# Altium project ADAS_ECU_revA.PrjPcb (part 3 of 6)

## Sheet STM32G473RET6_PINOUT.SchDoc
size C; SheetNumber: 17; SheetTotal: 23
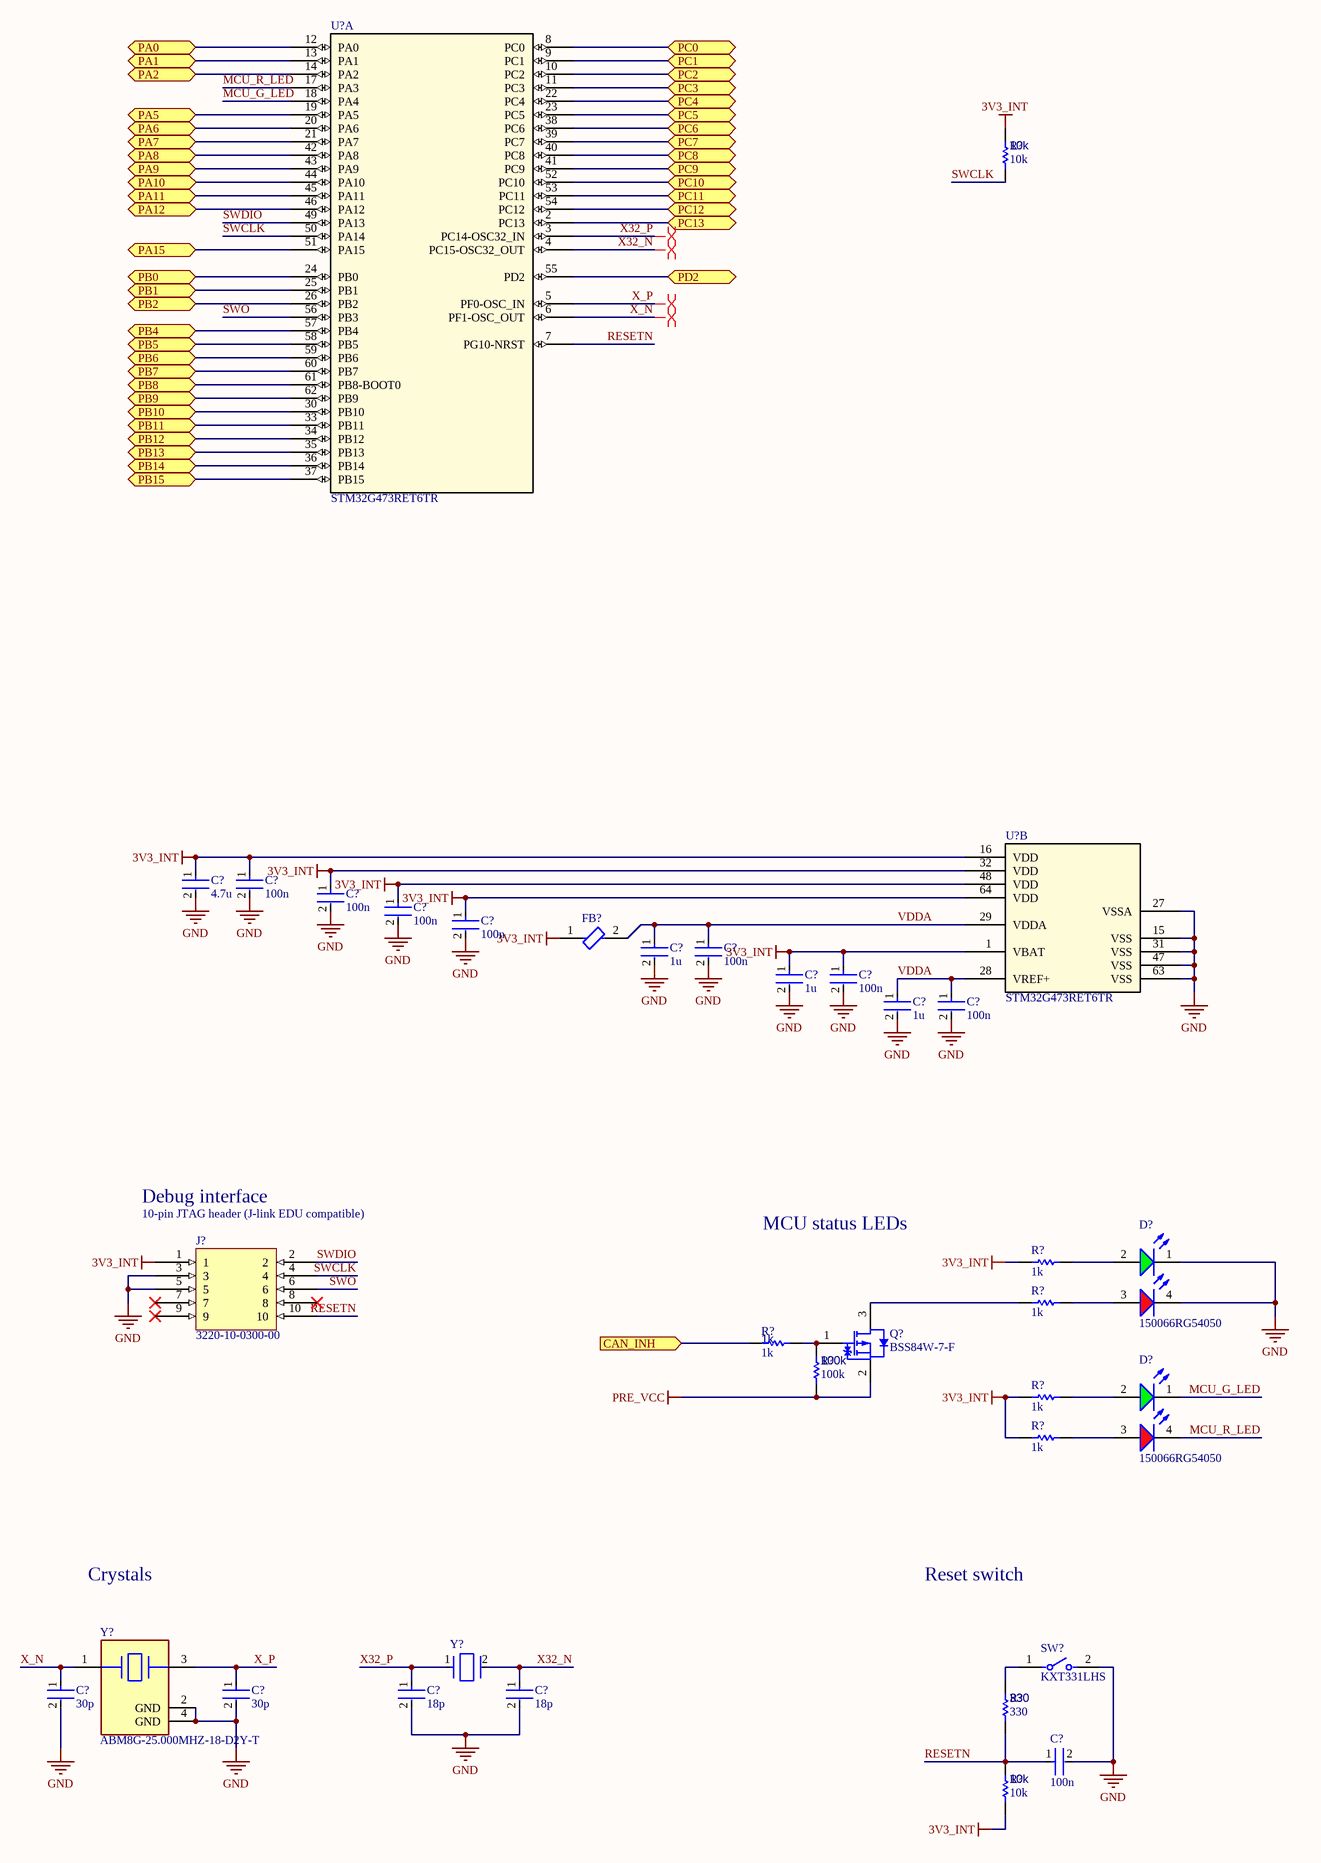
[diagram p21: STM32G473RET6_PINOUT.SchDoc]

### Parts
(Parts that share a designator on the sheet are numbered #1, #2 ... from top to bottom, then left to right.)
C?#1  4.7u  [FP-0402-L_1_0_0_05-W_0_5-IPC_A]
C?#2  100n  [FP-0402-L_1_0_0_05-W_0_5-IPC_A]
C?#3  100n  [FP-0402-L_1_0_0_05-W_0_5-IPC_A]
C?#4  100n  [FP-0402-L_1_0_0_05-W_0_5-IPC_A]
C?#5  100n  [FP-0402-L_1_0_0_05-W_0_5-IPC_A]
C?#6  1u  [FP-0402-L_1_0_0_05-W_0_5-IPC_A]
C?#7  100n  [FP-0402-L_1_0_0_05-W_0_5-IPC_A]
C?#8  1u  [FP-0402-L_1_0_0_05-W_0_5-IPC_A]
C?#9  100n  [FP-0402-L_1_0_0_05-W_0_5-IPC_A]
C?#10  1u  [FP-0402-L_1_0_0_05-W_0_5-IPC_A]
C?#11  100n  [FP-0402-L_1_0_0_05-W_0_5-IPC_A]
C?#12  30p  [FP-0402-L_1_0_0_05-W_0_5-IPC_A]
C?#13  30p  [FP-0402-L_1_0_0_05-W_0_5-IPC_A]
C?#14  18p  [FP-0402-L_1_0_0_05-W_0_5-IPC_A]
C?#15  18p  [FP-0402-L_1_0_0_05-W_0_5-IPC_A]
C?#16  100n  [FP-0402-L_1_0_0_05-W_0_5-IPC_A]
D?#1  150066RG54050  [WL-SBCD_0606]
D?#2  150066RG54050  [WL-SBCD_0606]
FB?  BLM15PX601SN1D  [FP-BLM15-0_05-MFG]  (value not drawn)
J?  3220-10-0300-00  [3220-10-0300-00-Footprint-1]
Q?  BSS84W-7-F  [DIOD-SOT323-3_V]
R?#1  10k  [R0603B]
R?#2  1k  [R0603B]
R?#3  1k  [R0603B]
R?#4  1k  [R0603B]
R?#5  100k  [R0603B]
R?#6  1k  [R0603B]
R?#7  1k  [R0603B]
R?#8  330  [R0603B]
R?#9  10k  [R0603B]
SW?  KXT331LHS  [FP-KXT331LHS-MFG]
U?#1  STM32G473RET6TR  [STM32G473RET6TR-Footprint-1]  (part A of 2)
U?#2  STM32G473RET6TR  [STM32G473RET6TR-Footprint-1]  (part B of 2)
Y?#1  ABM8G-25.000MHZ-18-D2Y-T  [FP-ABM8G-MFG]
Y?#2  ECS-.327-12.5-1210-TR  [FP-ECX-1210-MFG]  (value not drawn)

### Ports
CAN_INH (in), PA0 (bidir), PA1 (bidir), PA2 (bidir), PA5 (bidir), PA6 (bidir), PA7 (bidir), PA8 (bidir), PA9 (bidir), PA10 (bidir), PA11 (bidir), PA12 (bidir), PA15 (bidir), PB0 (bidir), PB1 (bidir), PB2 (bidir), PB4 (bidir), PB5 (bidir), PB6 (bidir), PB7 (bidir), PB8 (bidir), PB9 (bidir), PB10 (bidir), PB11 (bidir), PB12 (bidir), PB13 (bidir), PB14 (bidir), PB15 (bidir), PC0 (bidir), PC1 (bidir), PC2 (bidir), PC3 (bidir), PC4 (bidir), PC5 (bidir), PC6 (bidir), PC7 (bidir), PC8 (bidir), PC9 (bidir), PC10 (bidir), PC11 (bidir), PC12 (bidir), PC13 (bidir), PD2 (bidir)

### Nets
3V3_INT: C?#1.1 C?#2.1 C?#3.1 C?#4.1 C?#5.1 C?#8.1 C?#9.1 FB?.1 J?.1 R?#1.2 R?#2.2 R?#6.2 R?#7.2 R?#9.1 U?#2.1(VBAT) U?#2.16(VDD) U?#2.32(VDD) U?#2.48(VDD) U?#2.64(VDD)
GND: C?#1.2 C?#2.2 C?#3.2 C?#4.2 C?#5.2 C?#6.2 C?#7.2 C?#8.2 C?#9.2 C?#10.2 C?#11.2 C?#12.2 C?#13.2 C?#14.2 C?#15.2 C?#16.2 D?#1.1(K) D?#1.4(K) J?.3 J?.5 SW?.2 U?#2.15(VSS) U?#2.27(VSSA) U?#2.31(VSS) U?#2.47(VSS) U?#2.63(VSS) Y?#1.2(GND) Y?#1.4(GND)
PRE_VCC: Q?.2(S) R?#5.2
MCU_G_LED: D?#2.1(K) U?#1.18(PA4)
MCU_R_LED: D?#2.4(K) U?#1.17(PA3)
RESETN: C?#16.1 J?.10 R?#8.1 R?#9.2 U?#1.7(PG10-NRST)
SWCLK: J?.4 R?#1.1 U?#1.50(PA14)
SWDIO: J?.2 U?#1.49(PA13)
SWO: J?.6 U?#1.56(PB3)
VDDA: C?#6.1 C?#7.1 C?#10.1 C?#11.1 FB?.2 U?#2.28(VREF+) U?#2.29(VDDA)
X32_N: C?#15.1 U?#1.4(PC15-OSC32_OUT) Y?#2.2(Out/In)
X32_P: C?#14.1 U?#1.3(PC14-OSC32_IN) Y?#2.1(In/Out)
X_N: C?#12.1 U?#1.6(PF1-OSC_OUT) Y?#1.1
X_P: C?#13.1 U?#1.5(PF0-OSC_IN) Y?#1.3
NetD?#1_2: D?#1.2(A) R?#2.1
NetD?#1_3: D?#1.3(A) R?#3.1
NetD?#2_2: D?#2.2(A) R?#6.1
NetD?#2_3: D?#2.3(A) R?#7.1
NetQ?_1: Q?.1(G) R?#4.1 R?#5.1
NetQ?_3: Q?.3(D) R?#3.2
NetR?#4_2: R?#4.2 ; port CAN_INH
NetR?#8_2: R?#8.2 SW?.1
NetU?#1_2: U?#1.2(PC13) ; port PC13
NetU?#1_8: U?#1.8(PC0) ; port PC0
NetU?#1_9: U?#1.9(PC1) ; port PC1
NetU?#1_10: U?#1.10(PC2) ; port PC2
NetU?#1_11: U?#1.11(PC3) ; port PC3
NetU?#1_12: U?#1.12(PA0) ; port PA0
NetU?#1_13: U?#1.13(PA1) ; port PA1
NetU?#1_14: U?#1.14(PA2) ; port PA2
NetU?#1_19: U?#1.19(PA5) ; port PA5
NetU?#1_20: U?#1.20(PA6) ; port PA6
NetU?#1_21: U?#1.21(PA7) ; port PA7
NetU?#1_22: U?#1.22(PC4) ; port PC4
NetU?#1_23: U?#1.23(PC5) ; port PC5
NetU?#1_24: U?#1.24(PB0) ; port PB0
NetU?#1_25: U?#1.25(PB1) ; port PB1
NetU?#1_26: U?#1.26(PB2) ; port PB2
NetU?#1_30: U?#1.30(PB10) ; port PB10
NetU?#1_33: U?#1.33(PB11) ; port PB11
NetU?#1_34: U?#1.34(PB12) ; port PB12
NetU?#1_35: U?#1.35(PB13) ; port PB13
NetU?#1_36: U?#1.36(PB14) ; port PB14
NetU?#1_37: U?#1.37(PB15) ; port PB15
NetU?#1_38: U?#1.38(PC6) ; port PC6
NetU?#1_39: U?#1.39(PC7) ; port PC7
NetU?#1_40: U?#1.40(PC8) ; port PC8
NetU?#1_41: U?#1.41(PC9) ; port PC9
NetU?#1_42: U?#1.42(PA8) ; port PA8
NetU?#1_43: U?#1.43(PA9) ; port PA9
NetU?#1_44: U?#1.44(PA10) ; port PA10
NetU?#1_45: U?#1.45(PA11) ; port PA11
NetU?#1_46: U?#1.46(PA12) ; port PA12
NetU?#1_51: U?#1.51(PA15) ; port PA15
NetU?#1_52: U?#1.52(PC10) ; port PC10
NetU?#1_53: U?#1.53(PC11) ; port PC11
NetU?#1_54: U?#1.54(PC12) ; port PC12
NetU?#1_55: U?#1.55(PD2) ; port PD2
NetU?#1_57: U?#1.57(PB4) ; port PB4
NetU?#1_58: U?#1.58(PB5) ; port PB5
NetU?#1_59: U?#1.59(PB6) ; port PB6
NetU?#1_60: U?#1.60(PB7) ; port PB7
NetU?#1_61: U?#1.61(PB8-BOOT0) ; port PB8
NetU?#1_62: U?#1.62(PB9) ; port PB9

Not connected (* = marked no-connect by the designer): J? 7* 8* 9*

### Layout directives
differential pair: X32_N, X32_P, X_N, X_P

### Notes on the sheet
- Debug interface
- (near J?) 10-pin JTAG header (J-link EDU compatible)
- MCU status LEDs
- Crystals
- Reset switch

### Library data of the parts
C?#1-C?#16 = CMP-001-00058-1: as C231-C233 on sheet JETSON_V2; Min Operating Temperature: -55°C; Mounting Technology: Surface Mount; Pins: 2; Case/Package: 0402; RoHS Compliant: Yes; Max Operating Temperature: 85°C
  C?#1: Value: 4.7u
  C?#2-C?#5 C?#7 C?#9 C?#11 C?#16: Value: 100n
  C?#6 C?#8 C?#10: Value: 1u
  C?#12 C?#13: Value: 30p
  C?#14 C?#15: Value: 18p
D?#1 D?#2 = CMP-004-00040-2: Led, Red/Grn, 180Mcd/230Mcd, 624Nm/525Nm Rohs Compliant: Yes; Source: rgled.SchLib; Component Type: Standard; Design Item ID: CMP-004-00034-2; Pins: 4
FB? = CMP-0686-00252-4: Chip Ferrite Bead, 0402, 600Ω @ 100MHz, 0.23Ω, 25%, 900mA; Number of Circuits: 1; Impedance: 600R; DC Resistance (DCR): 230mR; Material: Steel; Length: 1mm; Package Quantity: 10000; Height: 0.5mm; Width: 0.5mm; Max DC Current: 900mA; Number of Lines: 1; Termination: SMD/SMT; Packaging: Tape and Reel; Lead Free: Lead Free; Min Operating Temperature: -55°C; Max Operating Temperature: 125°C; Max Current Rating: 900mA; Case Code (Imperial): 0402; Number of Pins: 2; Current Rating: 900mA; Test Frequency: 100MHz; Case/Package: 0402; Tolerance: 25%; Case Code (Metric): 1005
J? = CMP-001-0013-3: CONN HEADER SMD 10POS 1.27MM
Q? = CMP-2000-06170-1: DIFF P/N!!! / P-Channel Enhancement Mode MOSFET, 310 mW, 20 V, -55 to 150 degC, 3-Pin SOT-323, RoHS, Tape and Reel; Manufacturer: Diodes Inc; Qg Gate Charge: 0.622nC; Drain-Source On Resistance-Max: 750mO; Rated Power Dissipation: 310mW; Drain-to-Source Voltage [Vdss]: 20V; Package Reference: SOT323; Datasheet Version: Rev. 3-2, 09/2013; Package Description: 3-Pin Small Outline Transistor, Body 2 x 1.25 mm, Pitch 0.65 mm; Mounting Technology: SurfaceMount; Manufacturer URL: http://www.diodes.com/; Datasheet URL: http://www.diodes.com/_files/datasheets/ds31861.pdf; Channel Type: P-Channel
R?#1-R?#9 = CMP-009-00002-14: Resistor
  R?#1 R?#9: Value: 10k
  R?#2-R?#4 R?#6 R?#7: Value: 1k
  R?#5: Value: 100k
  R?#8: Value: 330
SW? = CMP-10040-000029-1: SWITCH TACTILE SPST-NO 0.02A 15V; Operating Force: 240gf; Switch Travel: 0.13mm; Illumination Type: Non-Illuminated; Throw Configuration: SPST; Number of Ports: 1; Current Rating: 5A; Mechanical Life: 500000Cycles; Switch Function: Off-Mom; Connector Type: USB; Actuator Type: Standard; Gender: Receptacle; Number of Contacts: 24; Contact Plating: Gold; Insulation Color: Black; Min Operating Temperature: -40°C; Packaging: Tape and Reel; Flammability Rating: UL94 V-0; Max Operating Temperature: 85°C; Termination: Solder; Mount: Surface Mount
U?#1 U?#2 = CMP-020-00020-2: MCU 32-Bit STM32 ARM Cortex-M4 RISC 512KB Flash 1.71V to 3.6V 64-Pin LQFP T/R; RoHS Compliant: Yes
Y?#1 = CMP-2000-05733-3: Crystal 25MHz ±20ppm (Tol) ±30ppm (Stability) 18pF FUND 60Ω 4-Pin SMD T/R; Series Resistance: 60R; Length: 3.2mm; Depth: 2.5mm; Packaging: Tape and Reel; Min Operating Temperature: -40°C; Operating Frequency: 25 MHz; Lead Free: Lead Free; Number of Pins: 4; Frequency Tolerance: 20ppm; Radiation Hardening: No; Max Operating Temperature: 85°C; Termination: SMD/SMT; Frequency Stability: 30ppm; Frequency: 25MHz; Series: ABM8G; Mount: Surface Mount; Package Quantity: 1000; Height: 0.039inch; Width: 0.098inch; Case/Package: CSMD; ESR (Equivalent Series Resistance): 60R; Load Capacitance: 18pF; Tolerance: 20ppm
Y?#2 = CMP-40224-000006-1: CRYSTAL 32.7680KHZ 12.5PF SMD; Manufacturer: ECS International; Frequency: 32.768kHz; Esr: 90kΩ; Tolerance: 20ppm; Device Class L1: Passive Components; Load Capacitance: 12.5pF; Temperature: -40°C to +85°C; ComponentLink2URL: https://ecsxtal.com/store/pdf/ECX-1210.pdf; Series: ECX-1210; Octopart: https://octopart.com/ecs-.327-12.5-1210-tr-ecs+international-81221340; ComponentLink2Description: Datasheet; Temperature Range Low: -40°C; Digikey Description: CRYSTAL 32.7680KHZ 12.5PF SMD; Lead Free: Yes; RoHS: TRUE; Device Class L3: Crystals; Automotive: No; Category: Crys; Height: 0.5mm; Manufacturer Part Number: ECS-.327-12.5-1210-TR; Temperature Range High: +85°C; Device Class L2: Crystals / Oscillators; Package: ECX-1210

## Sheet TCAN1146_PINOUT.SchDoc
size B; SheetNumber: 15; SheetTotal: 19
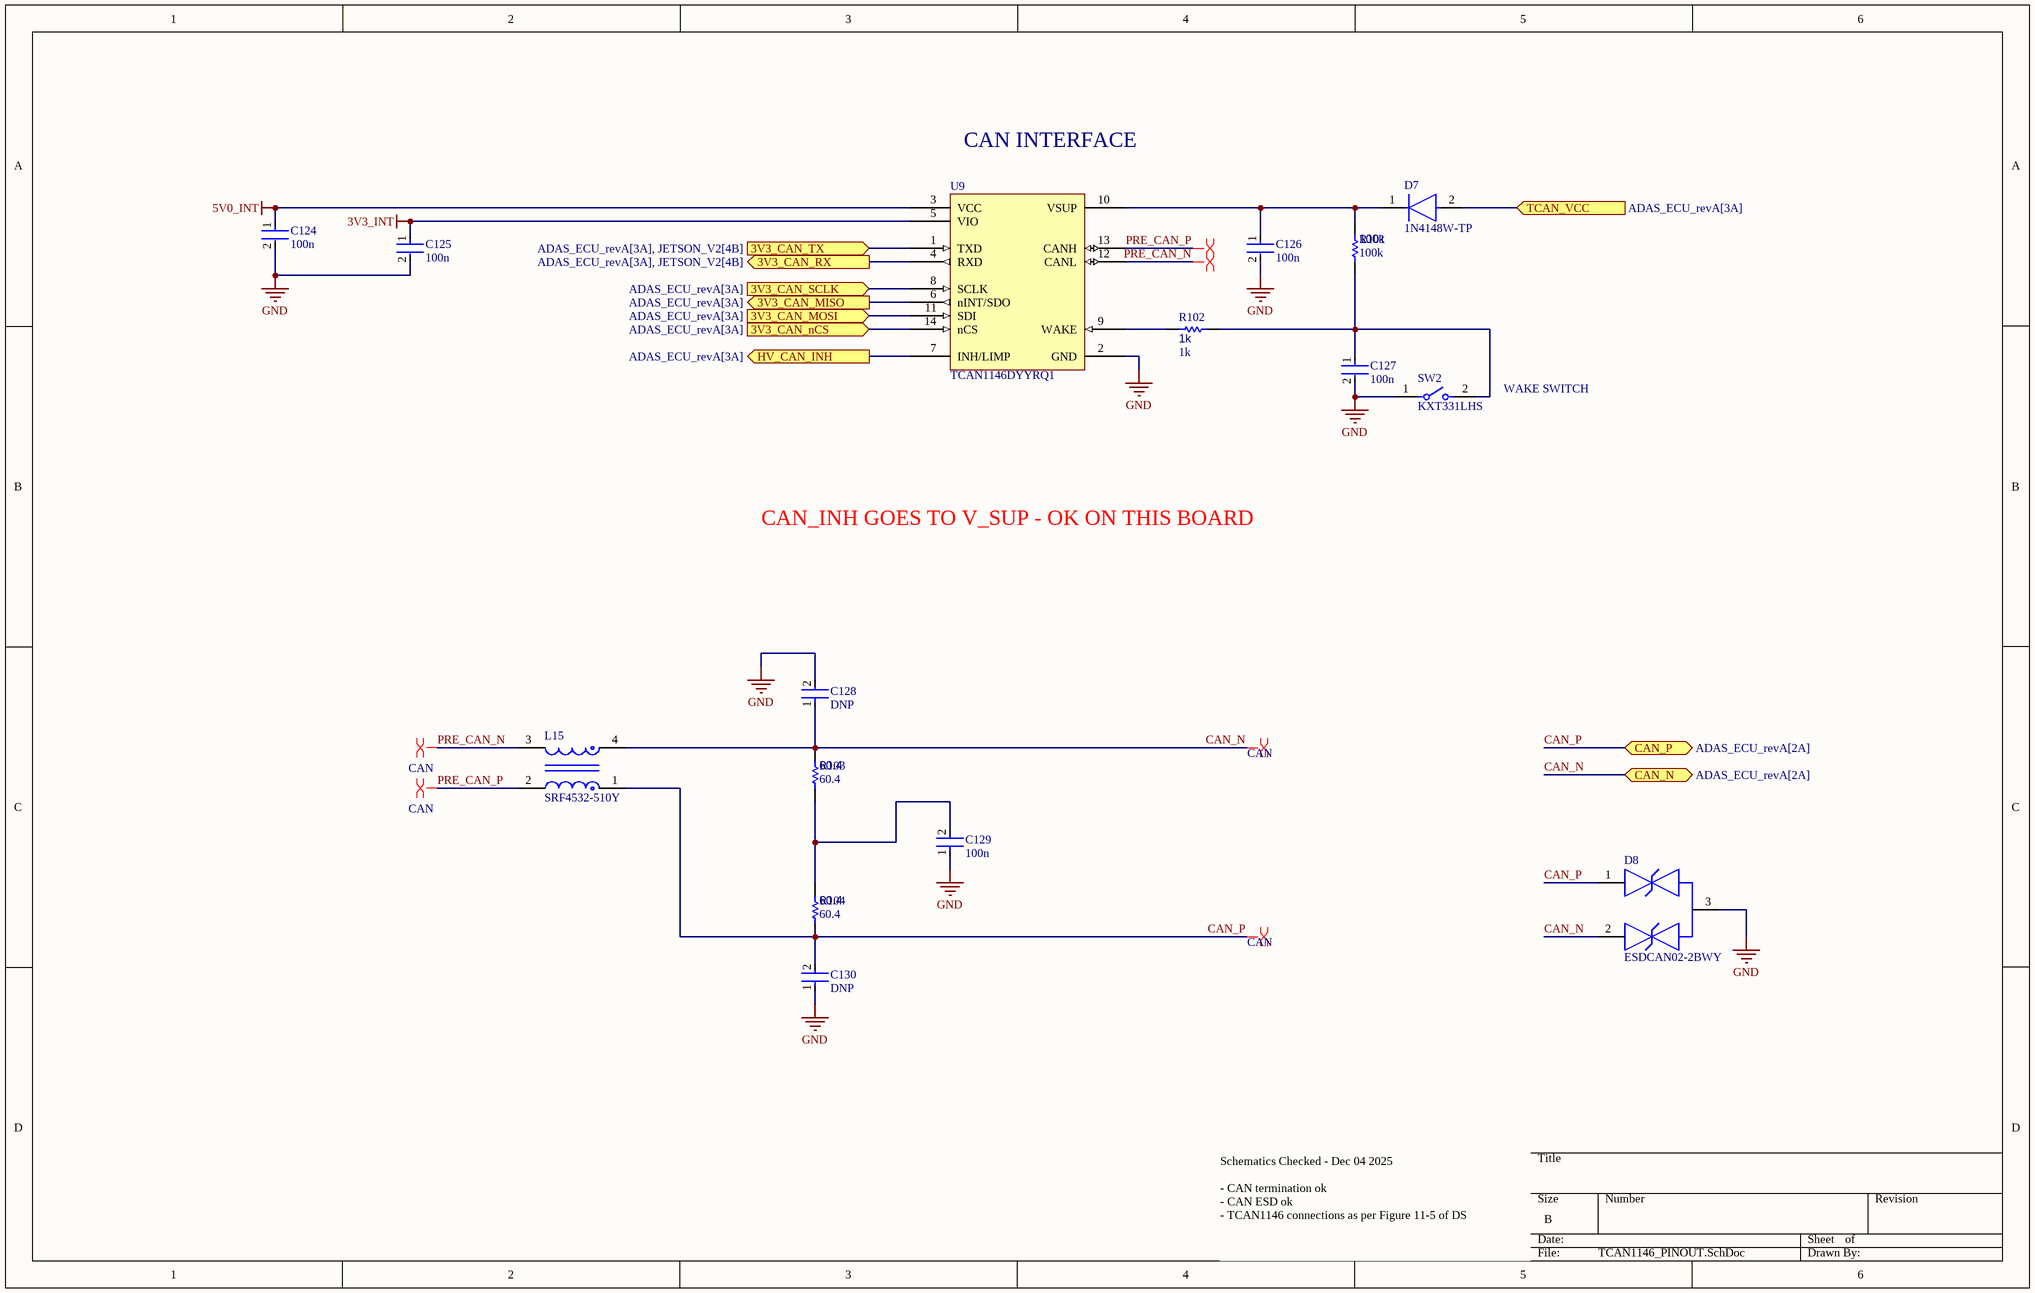
[diagram p22: TCAN1146_PINOUT.SchDoc]

### Parts
C124  100n  [FP-0402-L_1_0_0_05-W_0_5-IPC_A]
C125  100n  [FP-0402-L_1_0_0_05-W_0_5-IPC_A]
C126  100n  [FP-0402-L_1_0_0_05-W_0_5-IPC_A]
C127  100n  [FP-0402-L_1_0_0_05-W_0_5-IPC_A]
C128  DNP  [FP-0402-L_1_0_0_05-W_0_5-IPC_A]
C129  100n  [FP-0402-L_1_0_0_05-W_0_5-IPC_A]
C130  DNP  [FP-0402-L_1_0_0_05-W_0_5-IPC_A]
D7  1N4148W-TP  [FP-SOD-123-IPC_A]
D8  ESDCAN02-2BWY  [FP-SOT323-3L-MFG]
L15  SRF4532-510Y  [FP-SRF4532-MFG]
R101  100k  [R0603B]
R102  1k  [R0603B]
R103  60.4  [R0603B]
R104  60.4  [R0603B]
SW2  KXT331LHS  [FP-KXT331LHS-MFG]
U9  TCAN1146DYYRQ1  [TCAN1146DYYRQ1-Footprint-1]

### Ports
3V3_CAN_MISO (out, see ADAS_ECU_revA[3A]), 3V3_CAN_MOSI (in, see ADAS_ECU_revA[3A]), 3V3_CAN_nCS (in, see ADAS_ECU_revA[3A]), 3V3_CAN_RX (out, see ADAS_ECU_revA[3A], JETSON_V2[4B]), 3V3_CAN_SCLK (in, see ADAS_ECU_revA[3A]), 3V3_CAN_TX (in, see ADAS_ECU_revA[3A], JETSON_V2[4B]), CAN_N (bidir, see ADAS_ECU_revA[2A]), CAN_P (bidir, see ADAS_ECU_revA[2A]), HV_CAN_INH (out, see ADAS_ECU_revA[3A]), TCAN_VCC (in, see ADAS_ECU_revA[3A])

### Nets
3V3_INT: C125.1 U9.5(VIO)
5V0_INT: C124.1 U9.3(VCC)
GND: C124.2 C125.2 C126.2 C127.2 C128.2 C129.1 C130.1 D8.3 SW2.1 U9.2(GND)
PRE_VCC: D7.2(A) ; port TCAN_VCC
3V3_CAN_RX: U9.4(RXD) ; port 3V3_CAN_RX
3V3_CAN_TX: U9.1(TXD) ; port 3V3_CAN_TX
3V3_TCAN1146_MISO: U9.6(nINT/SDO) ; port 3V3_CAN_MISO
3V3_TCAN1146_MOSI: U9.11(SDI) ; port 3V3_CAN_MOSI
3V3_TCAN1146_nCS: U9.14(nCS) ; port 3V3_CAN_nCS
3V3_TCAN1146_SCLK: U9.8(SCLK) ; port 3V3_CAN_SCLK
CAN_N: C128.1 D8.2 L15.4 R103.2 ; port CAN_N
CAN_P: C130.2 D8.1 L15.1 R104.1 ; port CAN_P
HV_PWR_EN: U9.7(INH/LIMP) ; port HV_CAN_INH
PRE_CAN_N: L15.3 U9.12(CANL)
PRE_CAN_P: L15.2 U9.13(CANH)
NetC126_1: C126.1 D7.1(C) R101.2 U9.10(VSUP)
NetC127_1: C127.1 R101.1 R102.2 SW2.2
NetC129_2: C129.2 R103.1 R104.2
NetR102_1: R102.1 U9.9(WAKE)

### Layout directives
differential pair: PRE_CAN_N, PRE_CAN_P
differential pair; differential pair class CAN: CAN_N, CAN_P, PRE_CAN_N, PRE_CAN_P

### Notes on the sheet
- CAN INTERFACE
- WAKE SWITCH
- CAN_INH GOES TO V_SUP - OK ON THIS BOARD
- Schematics Checked - Dec 04 2025
  - CAN termination ok
  - CAN ESD ok
  - TCAN1146 connections as per Figure 11-5 of DS

### Library data of the parts
C124-C130 = CMP-001-00058-1: as C231-C233 on sheet JETSON_V2; Min Operating Temperature: -55°C; Mounting Technology: Surface Mount; Pins: 2; Case/Package: 0402; RoHS Compliant: Yes; Max Operating Temperature: 85°C
D7 = CMP-2000-04993-2: DIODE GEN PURP 100V 150MA SOD123; Max Reverse Leakage Current: 5uA; Max Surge Current: 2A; Reverse Recovery Time: 4ns; Polarity: Standard; Capacitance: 4pF; Max Forward Surge Current (Ifsm): 1A; Element Configuration: Single; Power Dissipation: 400mW; Forward Voltage: 1V; Radiation Hardening: No; Lead Free: Lead Free; Max Reverse Voltage (DC): 100V; Current Rating: 150mA; Forward Current: 150mA; Packaging: Tape and Reel; Number of Pins: 2; Package Quantity: 3000; Max Operating Temperature: 150°C; Min Operating Temperature: -65°C; Average Rectified Current: 150mA; Recovery Time: 4ns; Output Current: 150mA; Peak Non-Repetitive Surge Current: 2A; Width: 1.8mm; Voltage Rating (DC): 100V; Height: 1.2mm; Max Repetitive Reverse Voltage (Vrrm): 100V; Mount: Surface Mount; Length: 2.85mm
D8 = CMP-12225-000055-1: TVS DIODE 26.5V 44V SOT323-3; Manufacturer: STMicroelectronics; Value: 3pF; Direction: Bidirectional; Breakdown Voltage: 28.5V; Automotive Grade: Grade 0; Standoff Height: 0mm; Peak Pulse Power: 170W; Peak Pulse Current: 3A; Number Of Channels: 2; Max Junction Temp: +175°C; Mouser Description: TVS Diodes / ESD Suppressors Automotive dual-line Transil, Transient voltage suppressor (TVS) for CAN bus; Height: 1.1mm; Category: Diode; Reverse Standoff Voltage: 26.5V; Device Class L1: Circuit Protection; Temperature: -55°C to +175°C; RoHS: TRUE; ComponentLink2URL: https://www.st.com/resource/en/datasheet/esdcan02-2bwy.pdf; Device Class L3: unset; Device Class L2: TVS Diodes; Temperature Range High: +175°C; Octopart: https://octopart.com/esdcan02-2bwy-stmicroelectronics-58631133; Ipc Land Pattern Name: SOT65P210X95-3; Temperature Range Low: -55°C; Capacitance: 3pF; Digikey Description: TVS DIODE 26.5V 44V SOT323-3; Automotive: Yes; ComponentLink2Description: Datasheet; Clamping Voltage: 44V; Manufacturer Part Number: ESDCAN02-2BWY; Lead Free: Yes; Package: SOT323-3L
L15 = CMP-07251-000006-1: CMC 51UH 200MA 2LN 2KOHM SMD; Element Configuration: Dual; Number of Lines: 2; Core Material: Ferrite; Impedance: 2kR; Test Frequency: 100kHz; Voltage Rating (DC): 50V; Insulation Resistance: 10MR; Material: Steel; Tolerance: 50%; DC Resistance (DCR): 3.5R; RoHS Compliant: Yes; Mount: Surface Mount; REACH SVHC: No SVHC; Termination: SMD/SMT; DC Current: 200mA; Current: 200mA; Lead Free: Lead Free; Contact Plating: Tin; Length: 4.5mm; Max DC Current: 200mA; Width: 0.126inch; Case/Package: 4532; Packaging: Tape and Reel; Package Quantity: 1; Min Operating Temperature: -40°C; Depth: 3.4mm; Series: SRF4532; Max Operating Temperature: 125°C; Current Rating: 200mA; Self Resonant Frequency: 100kHz; Height: 0.118inch; Inductance: 51uH; Resistance: 2kR
R101-R104 = CMP-009-00002-14: Resistor
  R101: Value: 100k
  R102: Value: 1k
  R103 R104: Value: 60.4
SW2 = CMP-10040-000029-1: as SW? on sheet STM32G473RET6_PINOUT; Contact Plating: Gold; Insulation Color: Black; Min Operating Temperature: -40°C; Packaging: Tape and Reel; Flammability Rating: UL94 V-0; Max Operating Temperature: 85°C; Termination: Solder; Mount: Surface Mount
U9 = CMP-318-000000-2: Automotive CAN FD transceiver with watchdog, bus diagnostics and partial networking via sele 14-SOT-23-THIN -40 to 150; Component Type: Standard; Design Item ID: CMP-015-00012-2; Pin Count: 14; Source: TCAN1146DYYRQ1.SchLib

## Sheet LM74910H_PINOUT.SchDoc
size B; SheetNumber: 12; SheetTotal: 19
Used 2 times, as channels OR_0, OR_1. Parts and nets are listed once, with the designators drawn on the sheet.
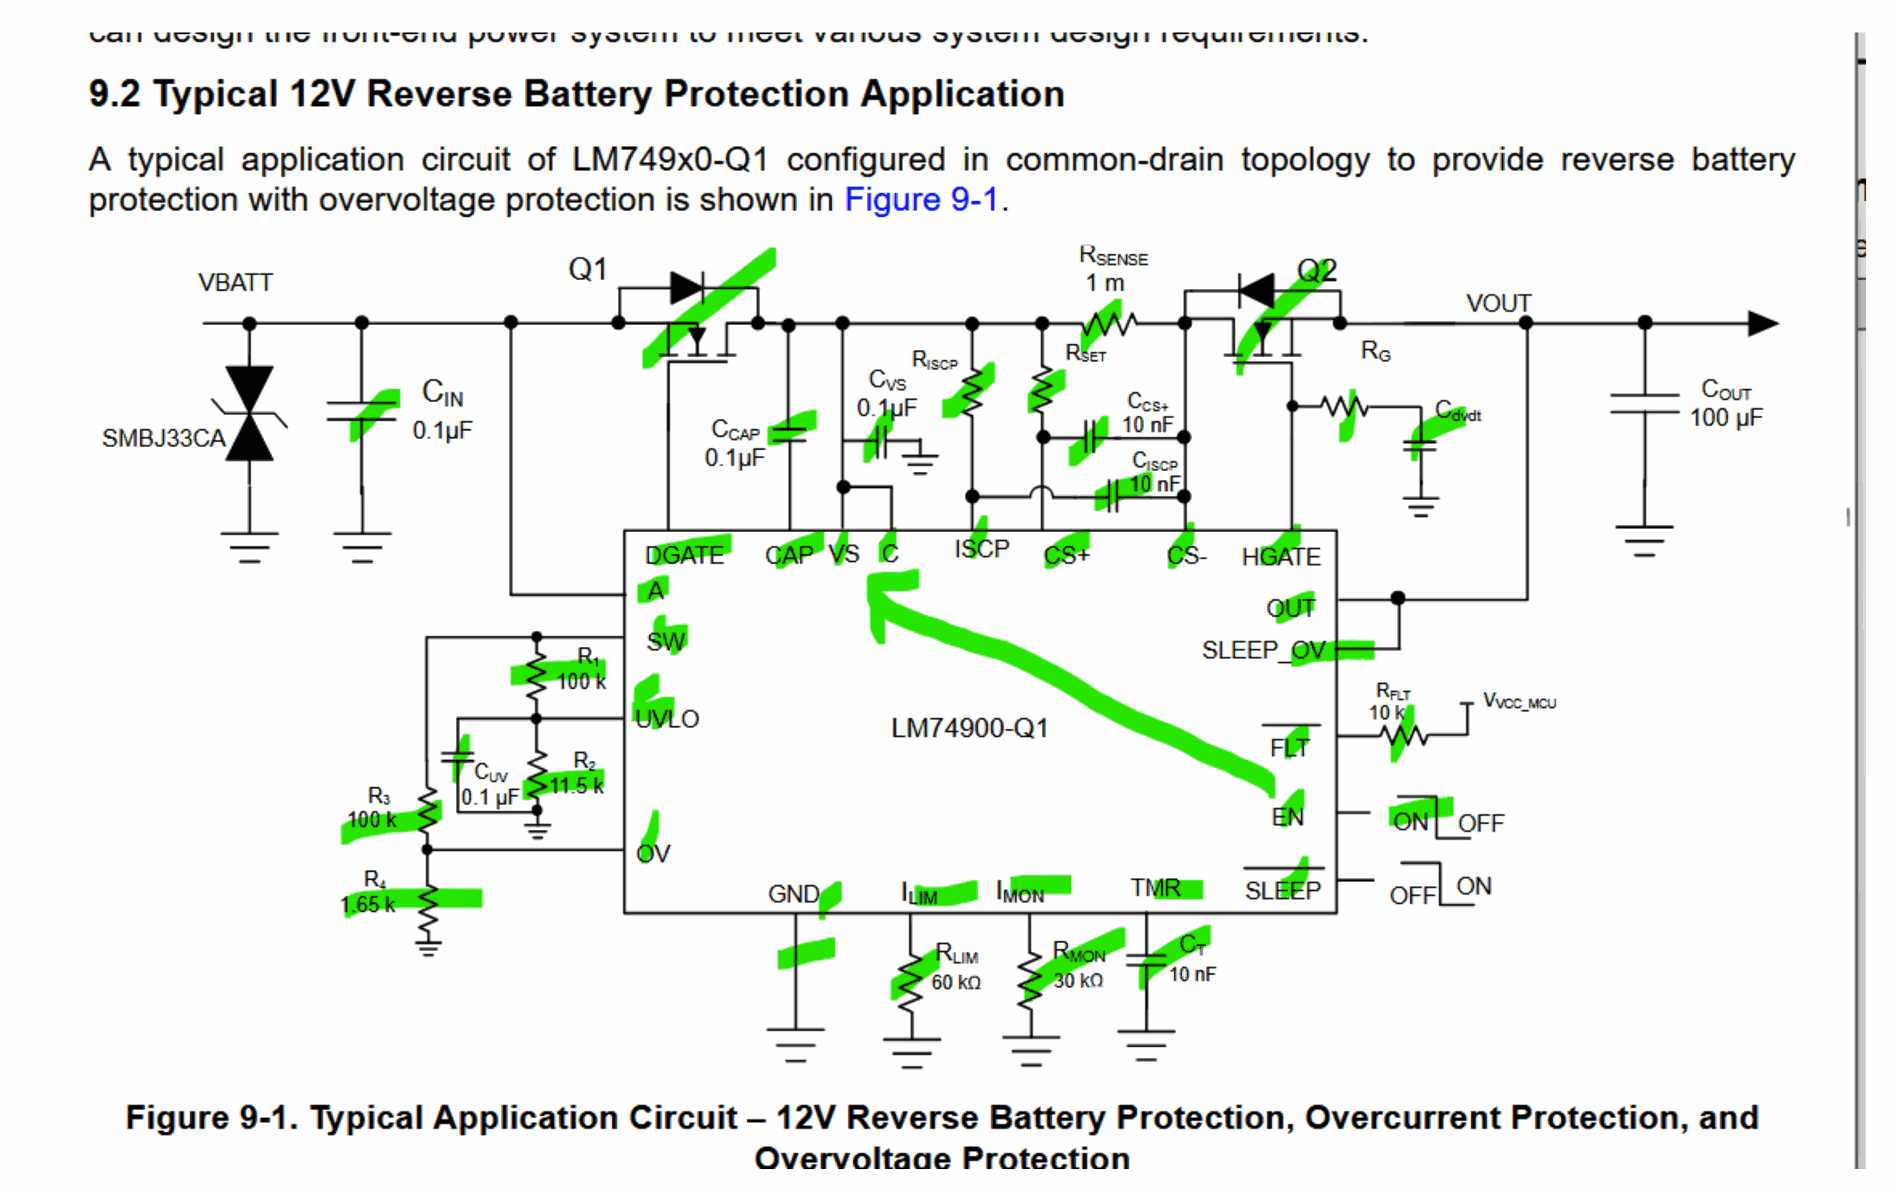
[diagram p23: LM74910H_PINOUT.SchDoc, top]
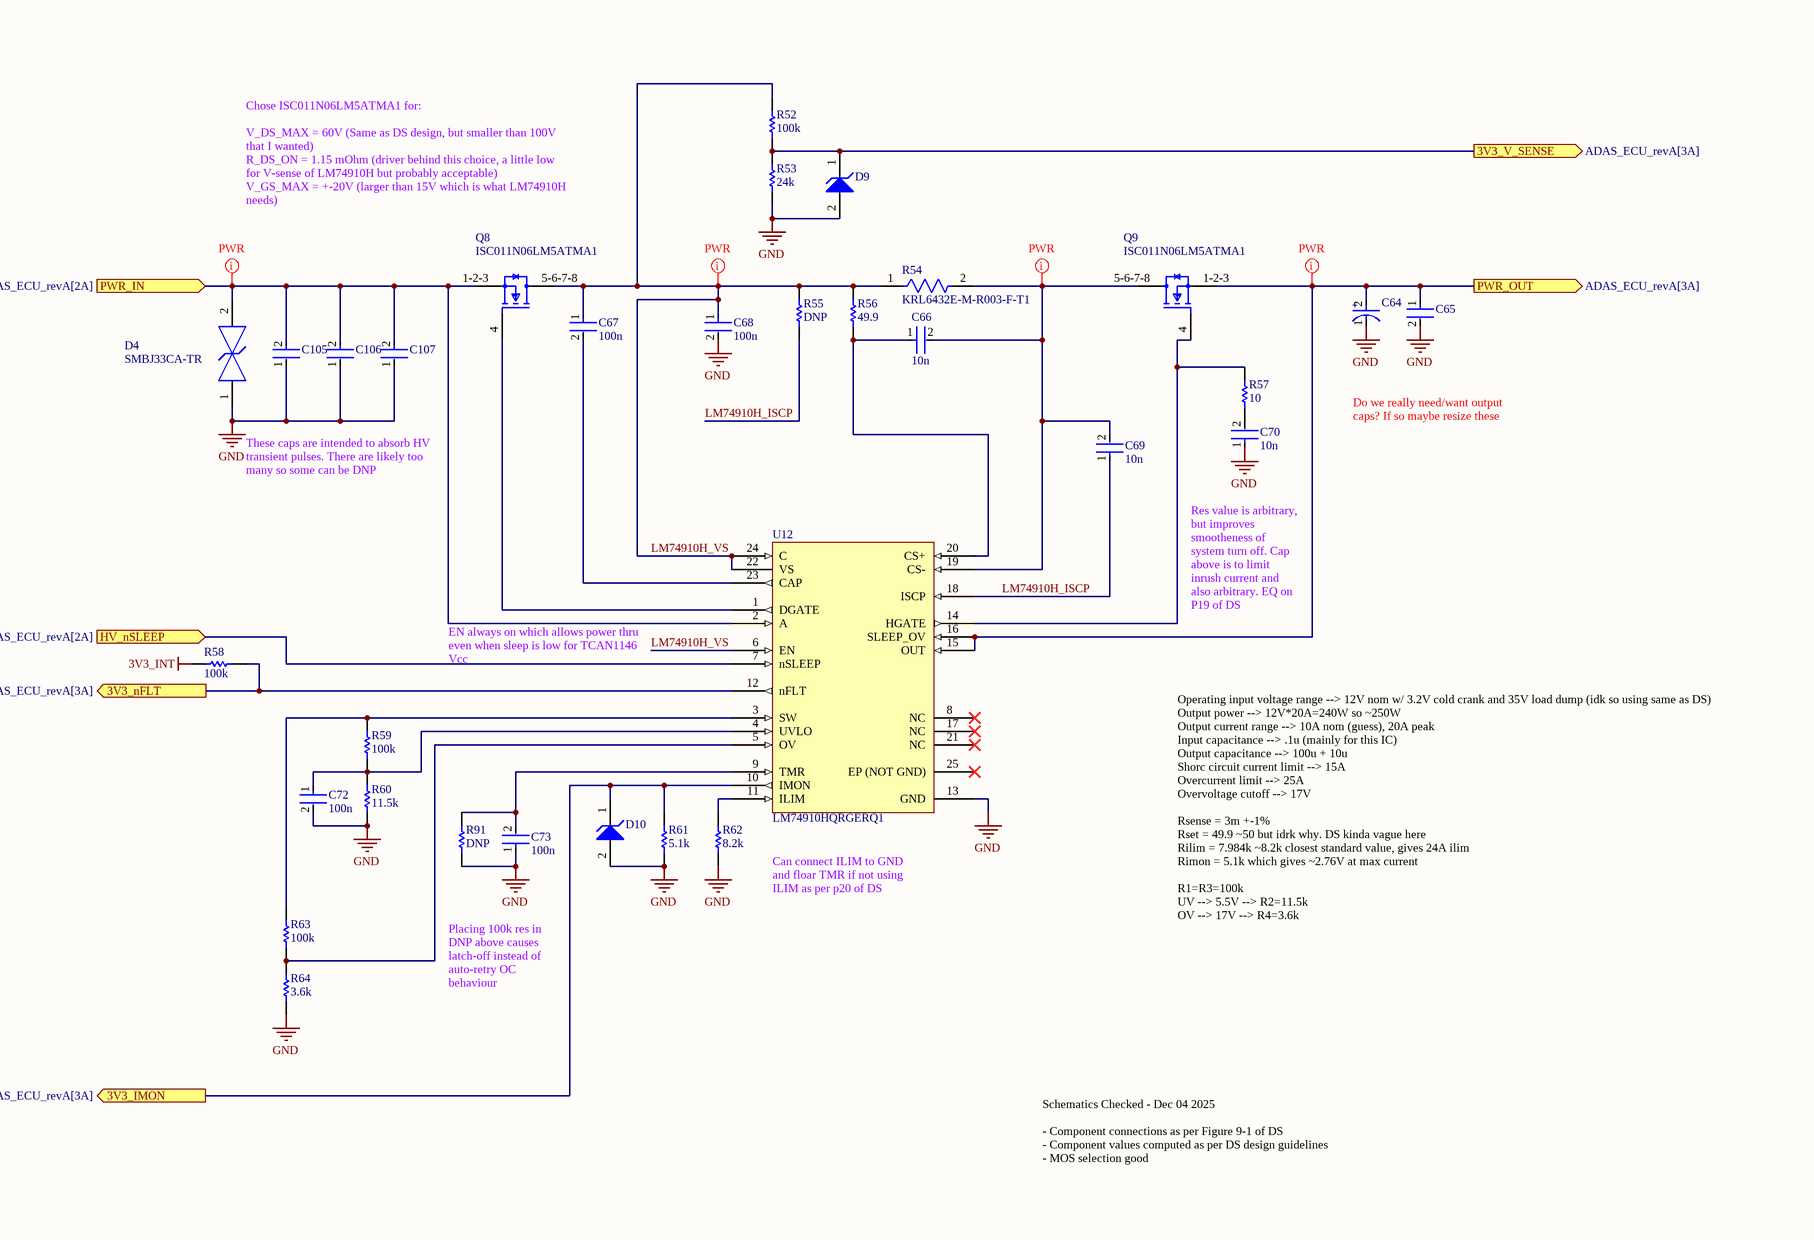
[diagram p24: LM74910H_PINOUT.SchDoc, bottom]

### Parts
C64  EEE-FK1H100UR  [FP-FKC-MFG]  (value not drawn)
C65  12103D106KAT2A  [FP-1210-L_3_3_0_4-W_2_5_0-MFG]  (value not drawn)
C66  10n  [FP-0402-L_1_0_0_05-W_0_5-IPC_A]
C67  100n  [FP-0402-L_1_0_0_05-W_0_5-IPC_A]
C68  100n  [FP-0402-L_1_0_0_05-W_0_5-IPC_A]
C69  10n  [FP-0402-L_1_0_0_05-W_0_5-IPC_A]
C70  10n  [FP-0402-L_1_0_0_05-W_0_5-IPC_A]
C72  100n  [FP-0402-L_1_0_0_05-W_0_5-IPC_A]
C73  100n  [FP-0402-L_1_0_0_05-W_0_5-IPC_A]
C105  AC1210KKX7R0BB104  [FP-AC1210-0_85-MFG]  (value not drawn)
C106  AC1210KKX7R0BB104  [FP-AC1210-0_85-MFG]  (value not drawn)
C107  AC1210KKX7R0BB104  [FP-AC1210-0_85-MFG]  (value not drawn)
D4  SMBJ33CA-TR  [FP-SMB-CA-MFG]
D9  DNP/MM5Z3V3T1G  [ONSC-SOD-523-2-502-01_V]  (value not drawn)
D10  DNP/MM5Z3V3T1G  [ONSC-SOD-523-2-502-01_V]  (value not drawn)
Q8  ISC011N06LM5ATMA1  [FP-PG-TDSON-8-MFG]
Q9  ISC011N06LM5ATMA1  [FP-PG-TDSON-8-MFG]
R52  100k  [R0603B]
R53  24k  [R0603B]
R54  KRL6432E-M-R003-F-T1  [FP-KRL6432E-MFG]
R55  DNP  [R0603B]
R56  49.9  [R0603B]
R57  10  [R0603B]
R58  100k  [R0603B]
R59  100k  [R0603B]
R60  11.5k  [R0603B]
R61  5.1k  [R0603B]
R62  8.2k  [R0603B]
R63  100k  [R0603B]
R64  3.6k  [R0603B]
R91  DNP  [R0603B]
U12  LM74910HQRGERQ1  [QFN50P400X400X100_HS-25N]

### Ports
3V3_IMON (out, see ADAS_ECU_revA[3A]), 3V3_nFLT (out, see ADAS_ECU_revA[3A]), 3V3_V_SENSE (out, see ADAS_ECU_revA[3A]), HV_nSLEEP (in, see ADAS_ECU_revA[2A]), PWR_IN (in, see ADAS_ECU_revA[2A]), PWR_OUT (out, see ADAS_ECU_revA[3A])

### Nets
3V3_INT: R58.2
GND: C64.1(C) C65.2 C68.2 C70.1 C72.2 C73.1 C105.1 C106.1 C107.1 D4.1 D9.2(A) D10.2(A) R53.1 R60.1 R61.1 R62.1 R64.1 R91.1 U12.13(GND)
3V3_IMON: D10.1(K) R61.2 U12.10(IMON) ; port 3V3_IMON
3V3_nFLT: R58.1 U12.12(nFLT) ; port 3V3_nFLT
3V3_V_SENSE: D9.1(K) R52.1 R53.2 ; port 3V3_V_SENSE
HV_nSLEEP: U12.7(nSLEEP) ; port HV_nSLEEP
LM74910H_ISCP: C69.1 R55.1 U12.18(ISCP)
LM74910H_VS: C67.1 C68.1 Q8.5-6-7-8(D) R52.2 R54.1 R55.2 R56.2 U12.6(EN) U12.22(VS) U12.24(C)
PWR_IN: C105.2 C106.2 C107.2 D4.2 Q8.1-2-3(S) U12.2(A) ; port PWR_IN
PWR_OUT: C64.2(A) C65.1 Q9.1-2-3(S) U12.15(OUT) U12.16(SLEEP_OV) ; port PWR_OUT
NetC66_1: C66.1 R56.1 U12.20(CS+)
NetC66_2: C66.2 C69.2 Q9.5-6-7-8(D) R54.2 U12.19(CS-)
NetC67_2: C67.2 U12.23(CAP)
NetC70_2: C70.2 R57.1
NetC72_1: C72.1 R59.1 R60.2 U12.4(UVLO)
NetC73_2: C73.2 R91.2 U12.9(TMR)
NetQ8_4: Q8.4(G) U12.1(DGATE)
NetQ9_4: Q9.4(G) R57.2 U12.14(HGATE)
NetR59_2: R59.2 R63.2 U12.3(SW)
NetR62_2: R62.2 U12.11(ILIM)
NetR63_1: R63.1 R64.2 U12.5(OV)

Not connected (* = marked no-connect by the designer): U12 8(NC)* 17(NC)* 21(NC)* 25(EP_(NOT_GND))*

### Channels
OR_0: designators end in _OR_0; ports 3V3_IMON=3V3_CAR_VCC_I_SENSE 3V3_nFLT=3V3_CAR_OR_nFLT 3V3_V_SENSE=3V3_CAR_VCC_V_SENSE HV_nSLEEP=HV_PWR_EN PWR_IN=CAR_VCC PWR_OUT=PRE_VCC
OR_1: designators end in _OR_1; ports 3V3_IMON=3V3_CAR_APM_I_SENSE 3V3_nFLT=3V3_APM_OR_nFLT 3V3_V_SENSE=3V3_CAR_APM_V_SENSE HV_nSLEEP=HV_PWR_EN PWR_IN=APM_VCC PWR_OUT=PRE_VCC

### Layout directives
net class PWR: CAR_VCC, LM74910H_VS_OR_0, NetC66_OR_0_2, PRE_VCC

### Notes on the sheet
- Chose ISC011N06LM5ATMA1 for:
  V_DS_MAX = 60V (Same as DS design, but smaller than 100V that I wanted)
  R_DS_ON = 1.15 mOhm (driver behind this choice, a little low for V-sense of LM74910H but probably acceptable)
  V_GS_MAX = +-20V (larger than 15V which is what LM74910H needs)
- These caps are intended to absorb HV transient pulses. There are likely too many so some can be DNP
- Do we really need/want output caps? If so maybe resize these
- Res value is arbitrary, but improves smootheness of system turn off. Cap above is to limit inrush current and also arbitrary. EQ on P19 of DS
- EN always on which allows power thru even when sleep is low for TCAN1146 Vcc
- Can connect ILIM to GND and floar TMR if not using ILIM as per p20 of DS
- Placing 100k res in DNP above causes latch-off instead of auto-retry OC behaviour
- Operating input voltage range --> 12V nom w/ 3.2V cold crank and 35V load dump (idk so using same as DS)
  Output power --> 12V*20A=240W so ~250W
  Output current range --> 10A nom (guess), 20A peak
  Input capacitance --> .1u (mainly for this IC)
  Output capacitance --> 100u + 10u
  Shorc circuit current limit --> 15A
  Overcurrent limit --> 25A
  Overvoltage cutoff --> 17V
  Rsense = 3m +-1%
  Rset = 49.9 ~50 but idrk why. DS kinda vague here
  Rilim = 7.984k ~8.2k closest standard value, gives 24A ilim
  Rimon = 5.1k which gives ~2.76V at max current
  R1=R3=100k
  UV --> 5.5V --> R2=11.5k
  OV --> 17V --> R4=3.6k
- Schematics Checked - Dec 04 2025
  - Component connections as per Figure 9-1 of DS
  - Component values computed as per DS design guidelines
  - MOS selection good
- (in symbol CMP-05427-000030-1) +

### Library data of the parts
C64 = CMP-05427-000030-1: CAP ALUM 10UF 20% 50V SMD; Impedance: 1.52R; Ripple Current (AC): 85mA; Life (Hours): 2000Hour; Leakage Current: 3uA; Dielectric Material: Aluminium; Length: 5.8mm; Voltage Rating: 50V; Radiation Hardening: No; Max Operating Temperature: 105°C; REACH SVHC: No SVHC; Tolerance: 20%; RoHS Compliant: Yes; Case/Package: Radial; Height: 5.8mm; Voltage: 50V; Diameter: 5mm; Number of Pins: 2; Ripple Current: 85mA; Series: FK; Lead Free: Lead Free; Width: 6.5mm; ESR (Equivalent Series Resistance): 1.52R; Package Quantity: 1000; Construction: Cylindrical; Voltage Rating (DC): 50V; Packaging: Tape and Reel; Height - Seated (Max): 0.228inch; Contact Plating: Tin; Capacitance: 10uF; Min Operating Temperature: -55°C; Termination: SMD/SMT; Material: Aluminium; Mount: Surface Mount
C65 = CMP-2000-05477-2: General Purpose Ceramic Capacitor, 1210, 10uF, 10%, X5R, 15%, 25V; Lead Free: Lead Free; Max Operating Temperature: 85°C; REACH SVHC: No SVHC; Depth: 2.5mm; Packaging: Tape and Reel; Min Operating Temperature: -55°C; Height: 2.29mm; Construction: Flat; Case Code (Imperial): 1210; Radiation Hardening: No; Voltage: 25V; Case/Package: 1210; Series: -; Dielectric: X5R; Length: 3.2mm; Thickness: 0.11inch; Package Quantity: 1; Termination: SMD/SMT; Case Code (Metric): 3225; Voltage Rating (DC): 25V; Voltage Rating: 25V; Contact Plating: Tin; RoHS Compliant: Yes; Mount: Surface Mount; Width: 0.098inch; Capacitance: 10uF; Tolerance: 10%
C66-C70 C72 C73 = CMP-001-00058-1: LARGE PADS, 0402 CAP, CHANGE COMMENT TO MATCH REAL P/N; Capacitor Type: Ceramic; Min Operating Temperature: -55°C; Mounting Technology: Surface Mount; Pins: 2; Case/Package: 0402; RoHS Compliant: Yes; Max Operating Temperature: 85°C
C105-C107 = CMP-03422-000642-1: CAP CER 0.1UF 100V X7R 1210; Manufacturer: Yageo; Automotive Grade: Grade 1; Capacitance: 100 nF; Material: Ceramic; Value: 100 nF; Temperature Coefficient: 15%; Tolerance: 0.1; Automotive: Yes; ComponentLink2Description: Datasheet; Device Class L2: Capacitors; Height: 0.95mm; Manufacturer Part Number: AC1210KKX7R0BB104; Temperature: -55°C to +125°C; Voltage Rating: 100 V; Device Class L1: Passive Components; ComponentLink2URL: http://www.yageo.com/documents/recent/UPY-AC_NP0X7R_16V-to-630V_12.pdf; Lead Free: Yes; Category: Cap; Temperature Range High: +125°C; RoHS: TRUE; Digikey Description: CAP CER 0.1UF 100V X7R 1210; Temperature Range Low: -55°C; Octopart: https://octopart.com/ac1210kkx7r0bb104-yageo-78873719; Device Class L3: Ceramic Capacitors; Ipc Land Pattern Name: CAPC320250X85; Package: AC1210-0.85; Footprint Url: http://www.yageo.com/exep/pages/download/literatures/UPY-C_GEN_24.pdf; Temperature Characteristic: X7R
D4 = CMP-12225-000040-1: TVS DIODE 33V 69.7V SMB; Manufacturer: STMicroelectronics; Direction: Bidirectional; Peak Pulse Current: 11.8A; Peak Pulse Power: 600W; Clamping Voltage: 53.3V; Breakdown Voltage: 36.7V; Number Of Channels: 1; Standoff Height: 0.05mm; Max Junction Temp: +150°C; Lead Free: Yes; Device Class L1: Circuit Protection; Device Class L3: unset; Mouser Description: TVS Diodes - Transient Voltage Suppressors 600W 33V Bidirect; Device Class L2: TVS Diodes; Temperature Range High: +150°C; Temperature: -55°C to +150°C; Temperature Range Low: -55°C; Octopart: https://octopart.com/smbj33ca-tr-stmicroelectronics-347069; Manufacturer Part Number: SMBJ33CA-TR; Automotive: No; ComponentLink2URL: https://www.st.com/resource/en/datasheet/smbj.pdf; RoHS: TRUE; Package: SMB-CA; Category: Diode; ComponentLink2Description: Datasheet; Height: 2.65mm; Reverse Standoff Voltage: 33V; Digikey Description: TVS DIODE 33V 69.7V SMB
D9 D10 = CMP-1060-00750-1: Zener Voltage Regulator, 500 mW, 2-Pin SOD-523, Pb-Free, Tape and Reel; Manufacturer: On Semiconductor; P Max (W): 0.5; VZ Typ (V): 3.3; RoHS: Pb-Free; ComponentLink2Description: Datasheet; PackageReference: SOD-523-2-502-01; DatasheetVersion: Rev. 10; ComponentLink1Description: Manufacturer URL; PackageVersion: Rev. E, 09/2010; ComponentLink3URL: http://www.onsemi.com/pub_link/Collateral/502-01.PDF; ComponentLink2URL: http://www.onsemi.cn/pub_link/Collateral/MM5Z2V4T1-D.PDF; Mounting Technology: Surface Mount; PartNumber: MM5Z3V3T1G; Packing: Tape and Reel; PackageDescription: 2-Pin SOD, Body 1.2 x 0.8 mm; ComponentLink1URL: http://www.onsemi.com/; ComponentLink3Description: Package Specification
Q8 Q9 = CMP-32901-001049-1: TRENCH 40<-<100V PG-TDSON-8
R52 R53 R55-R64 R91 = CMP-009-00002-14: Resistor
R54 = CMP-00597-24927456-1: KRL6432E-M-R003-F-T1 Metal Foil Low Resistance Chip Resistor (long-side terminal), 2512, RoHS; Tolerance: 1%; Resistance: 3mΩ; Temperature Coefficient: 50ppm/°C; Power Rating: 3W; Height: 700µm; NexarPartId: 24927456; Termination: SMD/SMT; Case Code (Metric): 6432; Min Operating Temperature: -55°C; Length: 3.1mm; Weight: 40.511469mg; Width: 6.3mm; Lifecycle Status: Production; Max Operating Temperature: 155°C; Case Code (Imperial): 2512; Composition: Metal Foil; Case/Package: 2512; Max Thickness: 700µm; RoHS: Compliant
U12 = CMP-019-00057-1: Automotive ideal diode with circuit breaker, 200-kHz ACS, UV , OV protection and SLEEP mode 24-VQFN -40 to 125; Pins: 24; Case/Package: VQFN

## Sheet FUSE_AND_I_SENSE.SchDoc
size A; SheetNumber: 13; SheetTotal: 19
Used 3 times, as channels PWR_PROT_0, PWR_PROT_1, PWR_PROT_2. Parts and nets are listed once, with the designators drawn on the sheet.
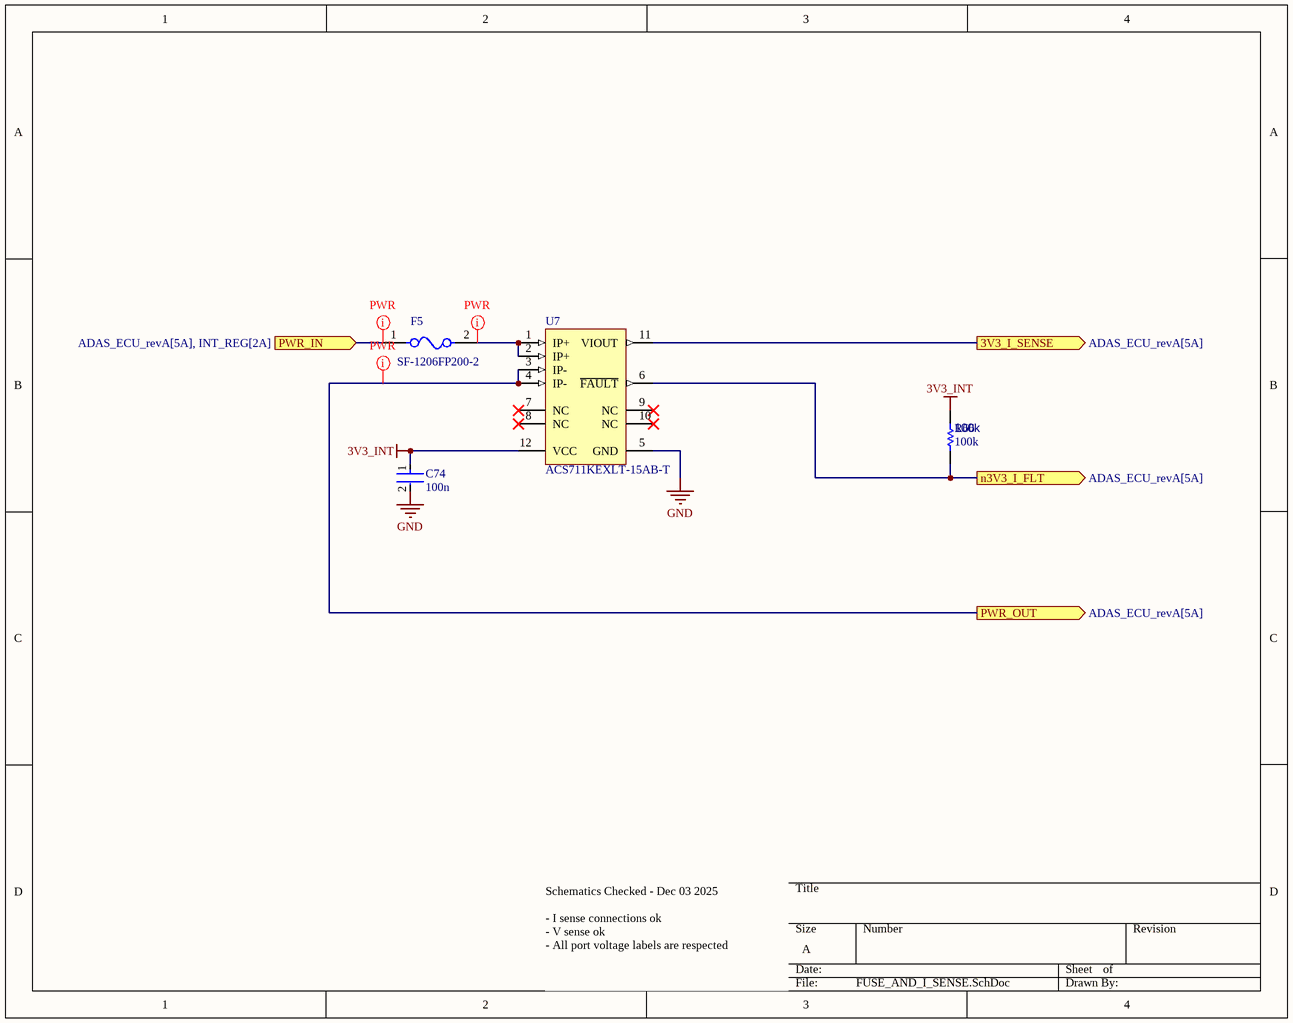
[diagram p25: FUSE_AND_I_SENSE.SchDoc]

### Parts
C74  100n  [FP-0402-L_1_0_0_05-W_0_5-IPC_A]
F5  SF-1206FP200-2  [FP-SF-1206FP-MFG]
R66  100k  [R0603B]
U7  ACS711KEXLT-15AB-T  [ALEG-EX-12_V]

### Ports
3V3_I_SENSE (out, see ADAS_ECU_revA[5A]), n3V3_I_FLT (out, see ADAS_ECU_revA[5A]), PWR_IN (in, see ADAS_ECU_revA[5A], INT_REG[2A]), PWR_OUT (out, see ADAS_ECU_revA[5A])

### Nets
3V3_INT: C74.1 R66.2 U7.12(VCC)
GND: C74.2 U7.5(GND)
3V3_I_SENSE: U7.11(VIOUT) ; port 3V3_I_SENSE
n3V3_I_FLT: R66.1 U7.6(~{FAULT}) ; port n3V3_I_FLT
PWR_IN: F5.1 ; port PWR_IN
PWR_OUT: U7.3(IP-) U7.4(IP-) ; port PWR_OUT
NetF5_2: F5.2 U7.1(IP+) U7.2(IP+)

Not connected (* = marked no-connect by the designer): U7 7(NC)* 8(NC)* 9(NC)* 10(NC)*

### Channels
PWR_PROT_0: designators end in _PWR_PROT_0; ports 3V3_I_SENSE=3V3_12V_VCC_I_SENSE n3V3_I_FLT=3V3_12V0_VCC_I_nFLT PWR_IN=INT_VCC PWR_OUT=12V0_MAIN_PWR_IN
PWR_PROT_1: designators end in _PWR_PROT_1; ports 3V3_I_SENSE=3V3_5V0_VCC_I_SENSE n3V3_I_FLT=3V3_5V0_VCC_I_nFLT PWR_IN=INT_VCC PWR_OUT=5V0_MAIN_PWR_IN
PWR_PROT_2: designators end in _PWR_PROT_2; ports 3V3_I_SENSE=3V3_3V3_VCC_I_SENSE n3V3_I_FLT=3V3_3V3_VCC_I_nFLT PWR_IN=INT_VCC PWR_OUT=3V3_MAIN_PWR_IN

### Layout directives
net class PWR: 12V0_MAIN_PWR_IN, INT_VCC, NetF5_PWR_PROT_0_2

### Notes on the sheet
- Schematics Checked - Dec 03 2025
  - I sense connections ok
  - V sense ok
  - All port voltage labels are respected

### Library data of the parts
C74 = CMP-001-00058-1: as C66-C70 on sheet LM74910H_PINOUT; Min Operating Temperature: -55°C; Mounting Technology: Surface Mount; Pins: 2; Case/Package: 0402; RoHS Compliant: Yes; Max Operating Temperature: 85°C
F5 = CMP-07399-000013-1: FUSE BOARD MOUNT 2A 63VDC 1206; Voltage Rating (DC): 63V; Fuse Type: Board Mount (Cartridge Style Excluded); Approvals: UL; Mount: Surface Mount; Min Operating Temperature: -20°C; Max Operating Temperature: 105°C; Case Code (Imperial): 1206; Packaging: Cut Tape; Current Rating: 2A; RoHS Compliant: Yes; Series: SinglFuse™ SF-1206FP; Case Code (Metric): 3216; Case/Package: 1206
R66 = CMP-009-00002-14: Resistor; Value: 100k
U7 = CMP-1557-00001-1: Hall Effect Linear Current Sensor with Overcurrent Fault Output for <100 V Isolation Applications, 3 to 5.5 V, -15.5 to 15.5 A IP, -40 to 125 degC, 12-Pin QFN (EX), RoHS, Tape and Reel; VCC Max: 5.5 V; IP Max: 15.5 A; VCC Min: 3 V; IP Min: -15.5 A; -3dB Bandwidth: 0.1 MHz; PackageDescription: 12-Pin Quad Flat No-Lead, Body 3 x 3 mm, Height 0.8 mm; ComponentLink1URL: http://www.allegromicro.com/; Packing: Tape and Reel; ComponentLink2URL: http://www.allegromicro.com/~/media/Files/Datasheets/ACS711-Datasheet.ashx?la=en; DatasheetVersion: Rev. 3; PartNumber: ACS711KEXLT-15AB-T; ComponentLink2Description: Datasheet; ComponentLink3URL: http://www.allegromicro.com/~/media/Files/Datasheets/ACS711-Datasheet.ashx?la=en; RoHS: TRUE; ComponentLink1Description: Manufacturer URL; ComponentLink3Description: Package Specification; Temperature Max: 125 degC; Mounting Technology: Surface Mount; Temperature Min: -40 degC

## Sheet LM704A0_5V0_PINOUT.SchDoc
size C; SheetNumber: 9; SheetTotal: 19
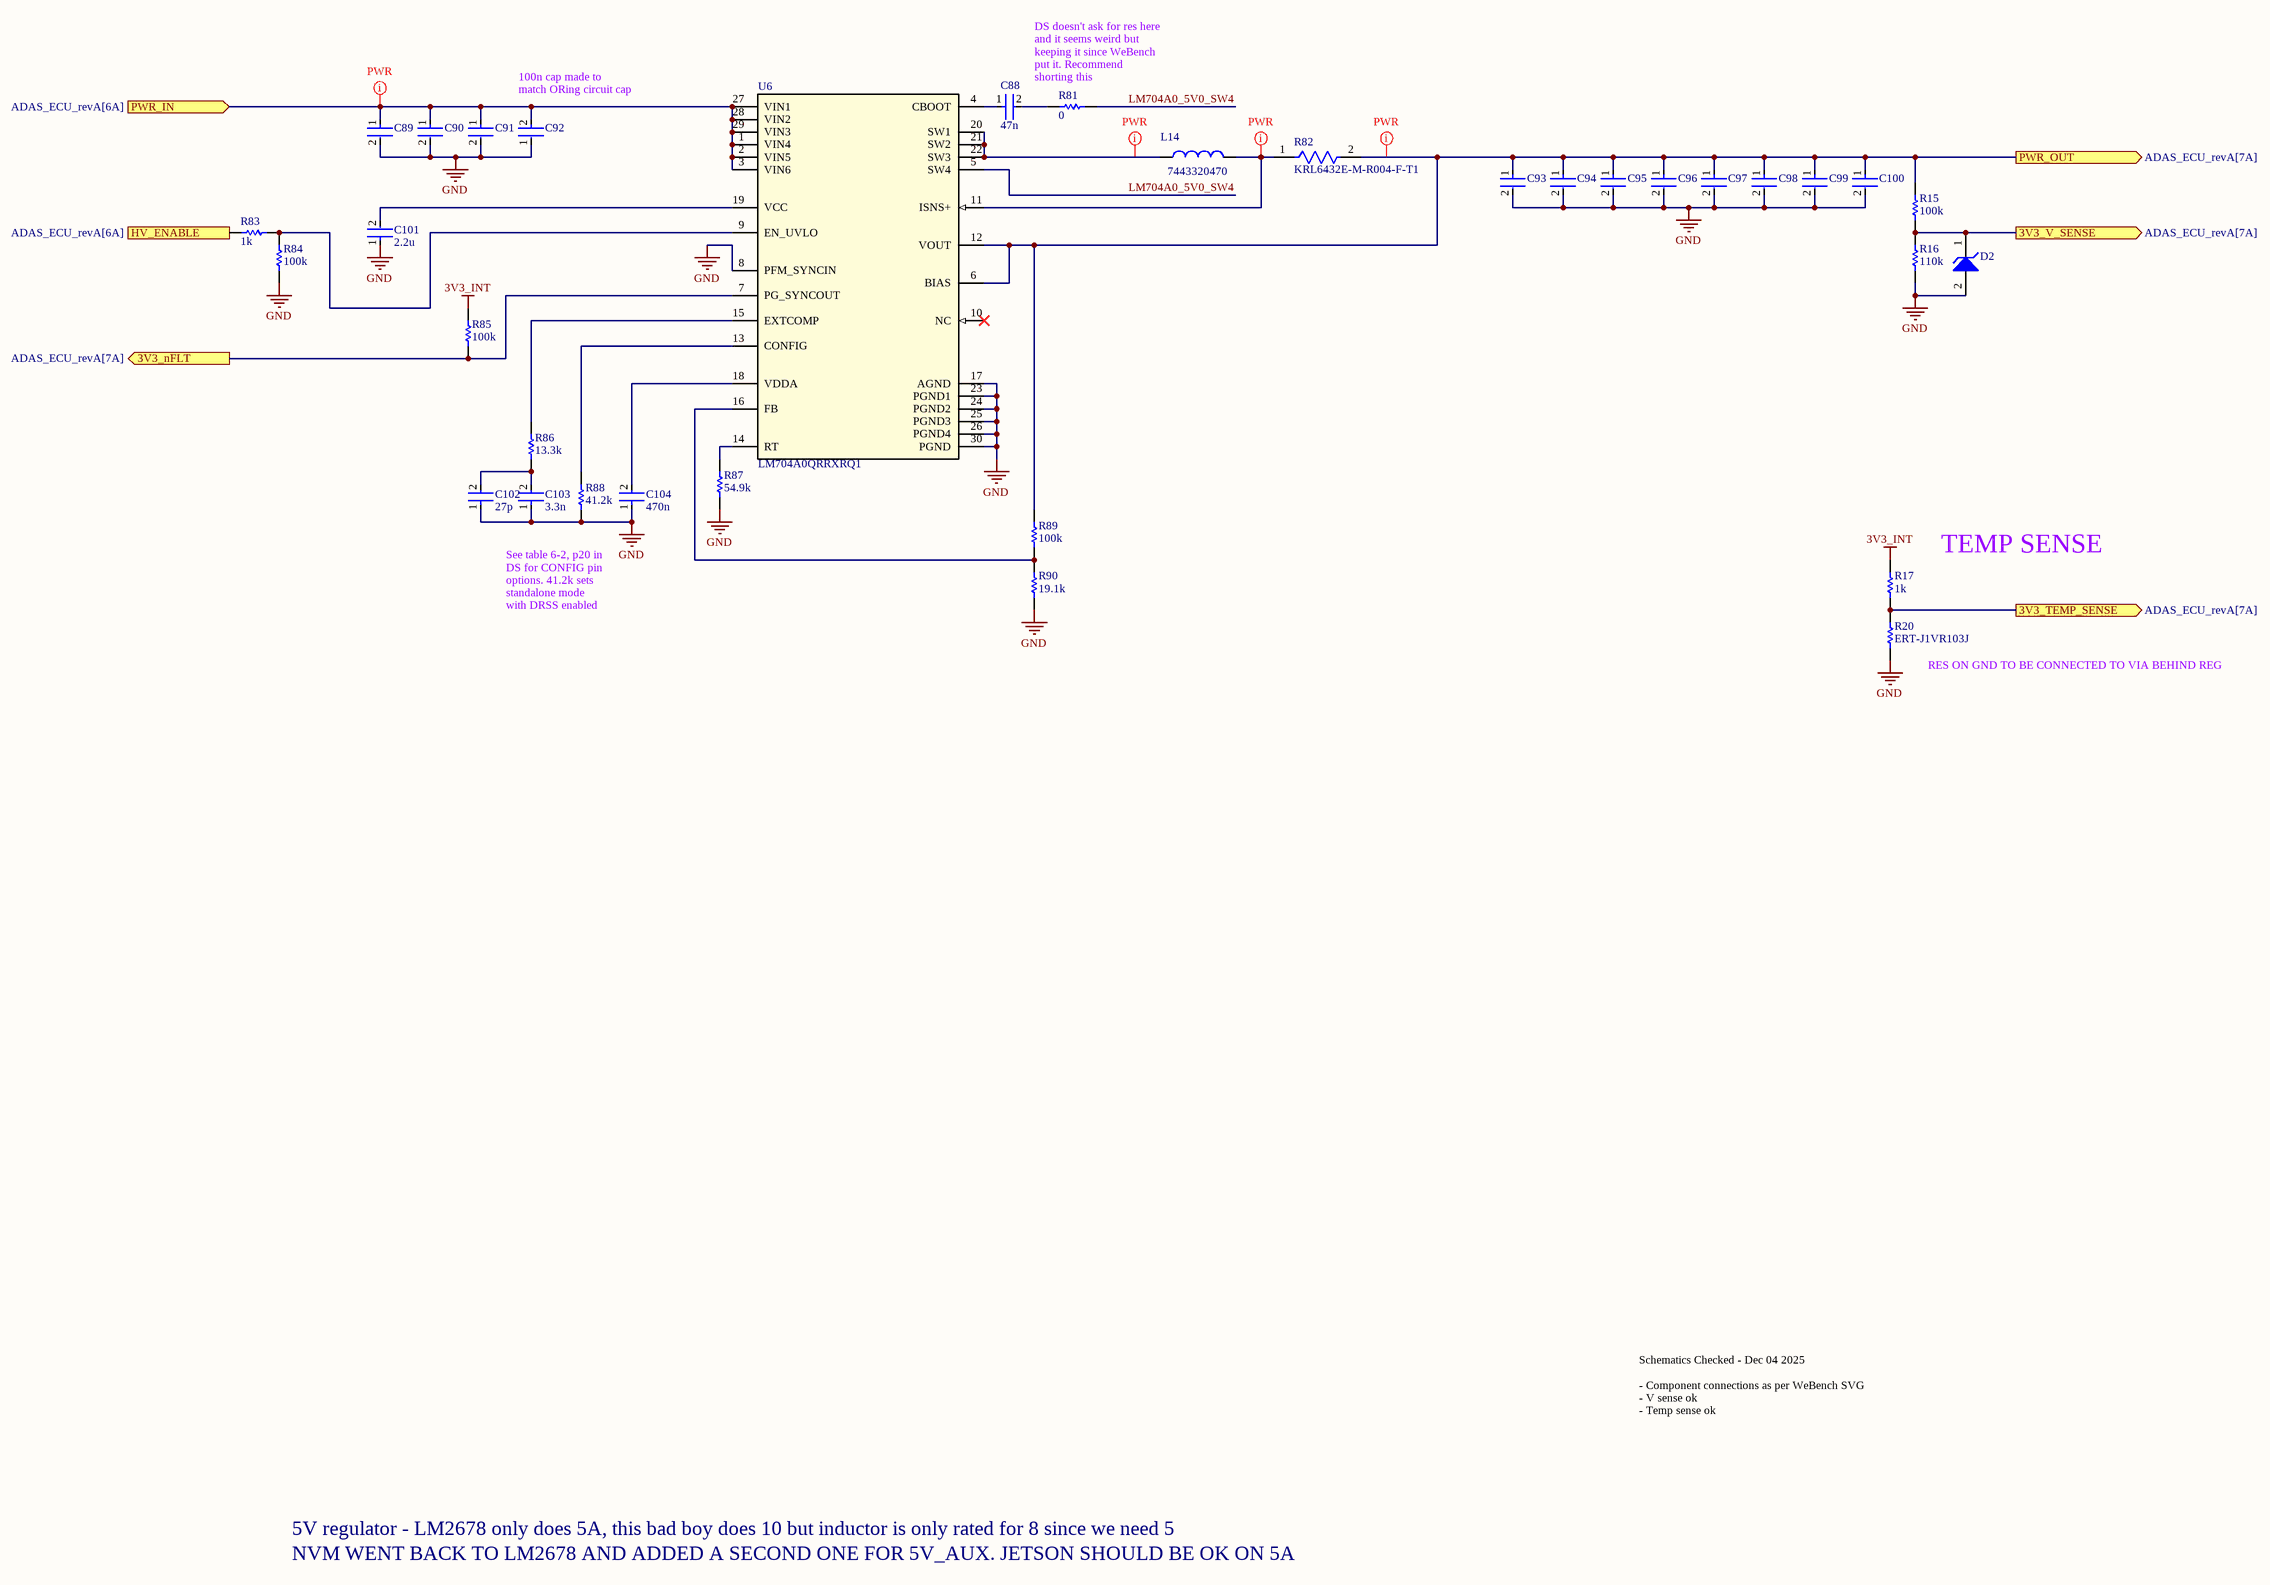
[diagram p26: LM704A0_5V0_PINOUT.SchDoc]

### Parts
C88  47n  [FP-0402-L_1_0_0_05-W_0_5-IPC_A]
C89  C3225X7R1H106M250AC  [FP-C3225-250-0_4-MFG]  (value not drawn)
C90  C3225X7R1H106M250AC  [FP-C3225-250-0_4-MFG]  (value not drawn)
C91  C3225X7R1H106M250AC  [FP-C3225-250-0_4-MFG]  (value not drawn)
C92  AC1210KKX7R0BB104  [FP-AC1210-0_85-MFG]  (value not drawn)
C93  GRM32ER61C476KE15L  [FP-GRM32E-0_3-0_2-IPC_C]  (value not drawn)
C94  GRM32ER61C476KE15L  [FP-GRM32E-0_3-0_2-IPC_C]  (value not drawn)
C95  GRM32ER61C476KE15L  [FP-GRM32E-0_3-0_2-IPC_C]  (value not drawn)
C96  GRM32ER61C476KE15L  [FP-GRM32E-0_3-0_2-IPC_C]  (value not drawn)
C97  GRM32ER61C476KE15L  [FP-GRM32E-0_3-0_2-IPC_C]  (value not drawn)
C98  GRM32ER61C476KE15L  [FP-GRM32E-0_3-0_2-IPC_C]  (value not drawn)
C99  GRM32ER61C476KE15L  [FP-GRM32E-0_3-0_2-IPC_C]  (value not drawn)
C100  GRM32ER61C476KE15L  [FP-GRM32E-0_3-0_2-IPC_C]  (value not drawn)
C101  2.2u  [FP-0402-L_1_0_0_05-W_0_5-IPC_A]
C102  27p  [FP-0402-L_1_0_0_05-W_0_5-IPC_A]
C103  3.3n  [FP-0402-L_1_0_0_05-W_0_5-IPC_A]
C104  470n  [FP-0402-L_1_0_0_05-W_0_5-IPC_A]
D2  MM5Z3V3T1G  [ONSC-SOD-523-2-502-01_V]  (value not drawn)
L14  7443320470  [WE-HCC_1210]
R15  100k  [R0603B]
R16  110k  [R0603B]
R17  1k  [R0603B]
R20  ERT-J1VR103J  [RESC1608X90X30ML15T20]
R81  0  [R0603B]
R82  KRL6432E-M-R004-F-T1  [FP-KRL6432E-MFG]
R83  1k  [R0603B]
R84  100k  [R0603B]
R85  100k  [R0603B]
R86  13.3k  [R0603B]
R87  54.9k  [R0603B]
R88  41.2k  [R0603B]
R89  100k  [R0603B]
R90  19.1k  [R0603B]
U6  LM704A0QRRXRQ1  [LM704A0QRRXRQ1-Footprint-1]

### Ports
3V3_nFLT (out, see ADAS_ECU_revA[7A]), 3V3_TEMP_SENSE (out, see ADAS_ECU_revA[7A]), 3V3_V_SENSE (out, see ADAS_ECU_revA[7A]), HV_ENABLE (in, see ADAS_ECU_revA[6A]), PWR_IN (in, see ADAS_ECU_revA[6A]), PWR_OUT (out, see ADAS_ECU_revA[7A])

### Nets
3V3_INT: R17.1 R85.2
5V0_MAIN: C93.1 C94.1 C95.1 C96.1 C97.1 C98.1 C99.1 C100.1 R15.1 R82.2 R89.1 U6.6(BIAS) U6.12(VOUT) ; port PWR_OUT
GND: C89.2 C90.2 C91.2 C92.1 C93.2 C94.2 C95.2 C96.2 C97.2 C98.2 C99.2 C100.2 C101.1 C102.1 C103.1 C104.1 D2.2(A) R16.2 R20.1 R84.1 R87.2 R88.2 R90.2 U6.8(PFM_SYNCIN) U6.17(AGND) U6.23(PGND1) U6.24(PGND2) U6.25(PGND3) U6.26(PGND4) U6.30(PGND)
3V3_5V0_MAIN_ENABLE: R83.2 ; port HV_ENABLE
3V3_5V0_MAIN_nFLT: R85.1 U6.7(PG_SYNCOUT) ; port 3V3_nFLT
3V3_5V0_MAIN_T_SENSE: R17.2 R20.2 ; port 3V3_TEMP_SENSE
3V3_5V0_MAIN_V_SENSE: D2.1(K) R15.2 R16.1 ; port 3V3_V_SENSE
5V0_MAIN_PWR_IN: C89.1 C90.1 C91.1 C92.2 U6.1(VIN4) U6.2(VIN5) U6.3(VIN6) U6.27(VIN1) U6.28(VIN2) U6.29(VIN3) ; port PWR_IN
LM704A0_5V0_SW4: R81.2 U6.5(SW4)
NetC88_1: C88.1 U6.4(CBOOT)
NetC88_2: C88.2 R81.1
NetC101_2: C101.2 U6.19(VCC)
NetC102_2: C102.2 C103.2 R86.1
NetC104_2: C104.2 U6.18(VDDA)
NetL14_1: L14.1 U6.20(SW1) U6.21(SW2) U6.22(SW3)
NetL14_2: L14.2 R82.1 U6.11(ISNS+)
NetR83_1: R83.1 R84.2 U6.9(EN_UVLO)
NetR86_2: R86.2 U6.15(EXTCOMP)
NetR87_1: R87.1 U6.14(RT)
NetR88_1: R88.1 U6.13(CONFIG)
NetR89_2: R89.2 R90.1 U6.16(FB)

Not connected (* = marked no-connect by the designer): U6 10(NC)*

### Layout directives
net class PWR: 5V0_MAIN, 5V0_MAIN_PWR_IN, NetL14_1, NetL14_2

### Notes on the sheet
- 100n cap made to match ORing circuit cap
- DS doesn't ask for res here and it seems weird but keeping it since WeBench put it. Recommend shorting this
- TEMP SENSE
- See table 6-2, p20 in DS for CONFIG pin options. 41.2k sets standalone mode with DRSS enabled
- (near R20) RES ON GND TO BE CONNECTED TO VIA BEHIND REG
- Schematics Checked - Dec 04 2025
  - Component connections as per WeBench SVG
  - V sense ok
  - Temp sense ok
- 5V regulator - LM2678 only does 5A, this bad boy does 10 but inductor is only rated for 8 since we need 5
- NVM WENT BACK TO LM2678 AND ADDED A SECOND ONE FOR 5V_AUX. JETSON SHOULD BE OK ON 5A

### Library data of the parts
C88 C101-C104 = CMP-001-00058-1: as C66-C70 on sheet LM74910H_PINOUT; Min Operating Temperature: -55°C; Mounting Technology: Surface Mount; Pins: 2; Case/Package: 0402; RoHS Compliant: Yes; Max Operating Temperature: 85°C
C89-C91 = CMP-08246-002653-1: Multilayer Ceramic Capacitors 10uF ±20% 50V X7R SMD 1210; Width: 0.098inch; Package Quantity: 1000; Height: 2.5mm; Dielectric Material: Ceramic; Voltage Rating: 50V; Series: C; Capacitance: 10uF; Tolerance: 20%; Weight: 0.000564oz; Case/Package: 1210; Case Code (Imperial): 1210; Dielectric: X7R; Case Code (Metric): 3225; REACH SVHC: No SVHC; Packaging: Tape and Reel; Length: 0.126inch; Termination: SMD/SMT; Min Operating Temperature: -55°C; Voltage Rating (DC): 50V; Lead Free: Lead Free; Max Operating Temperature: 125°C; Thickness: 0.11inch; Mount: Surface Mount
C92 = CMP-03422-000642-1: as C105 on sheet LM74910H_PINOUT; Automotive: Yes; ComponentLink2Description: Datasheet; Device Class L2: Capacitors; Height: 0.95mm; Manufacturer Part Number: AC1210KKX7R0BB104; Temperature: -55°C to +125°C; Voltage Rating: 100 V; Device Class L1: Passive Components; ComponentLink2URL: http://www.yageo.com/documents/recent/UPY-AC_NP0X7R_16V-to-630V_12.pdf; Lead Free: Yes; Category: Cap; Temperature Range High: +125°C; RoHS: TRUE; Digikey Description: CAP CER 0.1UF 100V X7R 1210; Temperature Range Low: -55°C; Octopart: https://octopart.com/ac1210kkx7r0bb104-yageo-78873719; Device Class L3: Ceramic Capacitors; Ipc Land Pattern Name: CAPC320250X85; Package: AC1210-0.85; Footprint Url: http://www.yageo.com/exep/pages/download/literatures/UPY-C_GEN_24.pdf; Temperature Characteristic: X7R
C93-C100 = CMP-2000-06362-2: CAP CER 47UF 16V X5R 1210; Tolerance: 10%; Material: Ceramic; Case Code (Metric): 3225; RoHS Compliant: Yes; Min Operating Temperature: -55°C; Radiation Hardening: No; Voltage: 16V; Package Quantity: 1; Case Code (Imperial): 1210; REACH SVHC: No SVHC; Capacitance: 47uF; Voltage Rating (DC): 16V; Dielectric: X5R; Case/Package: 1210; Length: 3.2mm; Voltage Rating: 16V; Packaging: Cut Tape; Width: 0.098inch; Number of Pins: 2; Lead Free: Lead Free; Height: 2.5mm; Mount: Surface Mount; Termination: SMD/SMT; Max Operating Temperature: 85°C; Thickness: 0.106inch; Depth: 2.5mm
D2 = CMP-1060-00750-1: as D9 on sheet LM74910H_PINOUT; RoHS: Pb-Free; ComponentLink2Description: Datasheet; PackageReference: SOD-523-2-502-01; DatasheetVersion: Rev. 10; ComponentLink1Description: Manufacturer URL; PackageVersion: Rev. E, 09/2010; ComponentLink3URL: http://www.onsemi.com/pub_link/Collateral/502-01.PDF; ComponentLink2URL: http://www.onsemi.cn/pub_link/Collateral/MM5Z2V4T1-D.PDF; Mounting Technology: Surface Mount; PartNumber: MM5Z3V3T1G; Packing: Tape and Reel; PackageDescription: 2-Pin SOD, Body 1.2 x 0.8 mm; ComponentLink1URL: http://www.onsemi.com/; ComponentLink3Description: Package Specification
L14 = CMP-0226-00121-3: We-hcc Series, Shielded Wire-wound SMD Inductor With Ferrite Core, 4.7 Uh; Inductance Tolerance: 20%; Self Resonant Frequency: 43MHz; Saturation Current: 15.6A; Current Rating: 15.5A; Inductance: 4.7µH; DC Resistance (DCR): 7.25mΩ; Width: 11.4mm; Core Material: Ferrite; Number of Pins: 2; Material: Ferrite; RoHS: Compliant; Length: 12.1mm; Max Operating Temperature: 125°C; Ambient Temperature Range Low: -40°C; Min Operating Temperature: -40°C; Height: 9.5mm; Ambient Temperature Range High: 75°C
R15 R17 R81 R83-R90 = CMP-009-00002-14: Resistor
  R15: Value: 100k
  R17: Value: 1k
R16 = CMP-009-00002-14: Resistor; Value: 100k
R20 = CMP-2000-00869-1: Manufacturer: Panasonic; Part Number: ERT-J1VR103J
R82 = CMP-00597-24927457-1: KRL6432E-M-R004-F-T1 Metal Foil Low Resistance Chip Resistor (long-side terminal), 2512, RoHS; Power Rating: 3W; Temperature Coefficient: 50ppm/°C; Tolerance: 1%; Resistance: 4mΩ; Length: 3.1mm; Composition: Metal Foil; Termination: SMD/SMT; Max Operating Temperature: 155°C; Case Code (Imperial): 2512; NexarPartId: 24927457; Width: 6.3mm; Max Power Dissipation: 3W; Case Code (Metric): 6432; Min Operating Temperature: -55°C; Packaging: Digi-Reel®; Max Thickness: 700µm; Lifecycle Status: Production; Height: 700µm; Weight: 40.511469mg; Case/Package: 2512; RoHS: Compliant; Number of Terminations: 2
U6 = CMP-019-00058-1: Automotive, High-density, 4.5V to 45V input, 10A low-EMI synchronous DC/DC step-down converter 29-VQFN -40 to 150; Case/Package: VQFN; Pins: 29

## Sheet INT_REG.SchDoc
size A4; SheetNumber: 12; SheetTotal: 25
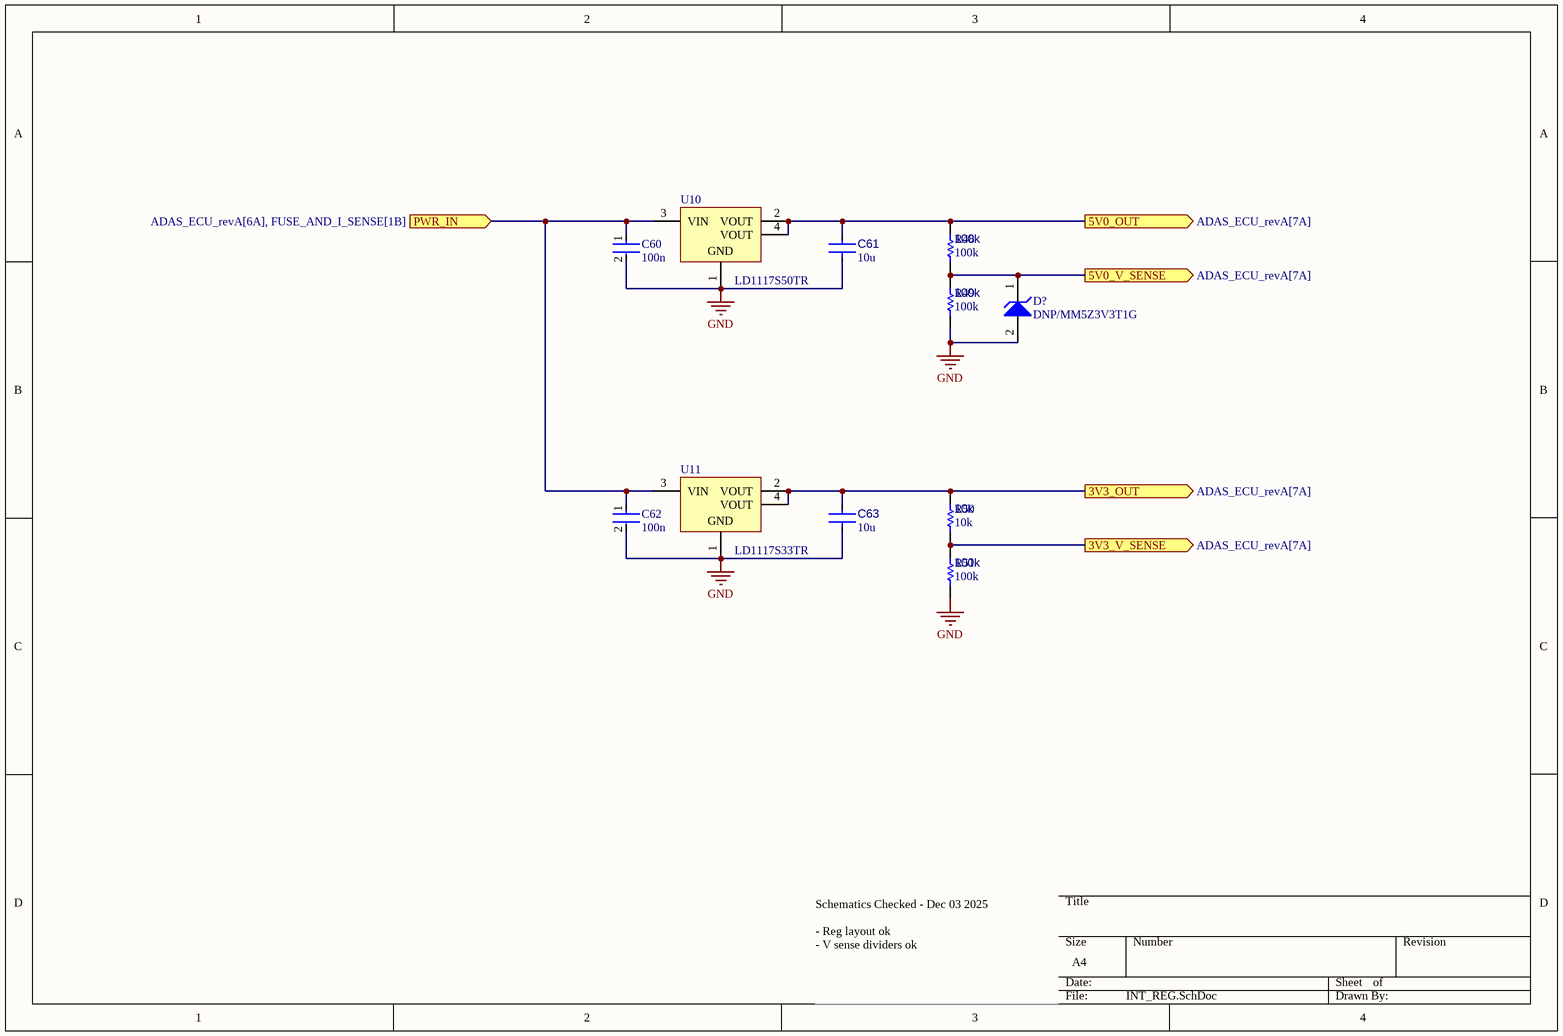
[diagram p27: INT_REG.SchDoc]

### Parts
(Parts that share a designator on the sheet are numbered #1, #2 ... from top to bottom, then left to right.)
C60  100n  [FP-0402-L_1_0_0_05-W_0_5-IPC_A]
C61  10u  [C0805A]
C62  100n  [FP-0402-L_1_0_0_05-W_0_5-IPC_A]
C63  10u  [C0805A]
D?#3  DNP/MM5Z3V3T1G  [ONSC-SOD-523-2-502-01_V]
R48  100k  [R0603B]
R49  100k  [R0603B]
R50  10k  [R0603B]
R51  100k  [R0603B]
U10  LD1117S50TR  [SOT-223_L]
U11  LD1117S33TR  [SOT-223_L]

### Ports
3V3_OUT (out, see ADAS_ECU_revA[7A]), 3V3_V_SENSE (out, see ADAS_ECU_revA[7A]), 5V0_OUT (out, see ADAS_ECU_revA[7A]), 5V0_V_SENSE (out, see ADAS_ECU_revA[7A]), PWR_IN (in, see ADAS_ECU_revA[6A], FUSE_AND_I_SENSE[1B])

### Nets
3V3_INT: C63.1 R50.1 U11.2(VOUT) U11.4(VOUT) ; port 3V3_OUT
5V0_INT: C61.1 R48.1 U10.2(VOUT) U10.4(VOUT) ; port 5V0_OUT
GND: C60.2 C61.2 C62.2 C63.2 D?#3.2(A) R49.2 R51.2 U10.1(GND) U11.1(GND)
INT_VCC: C60.1 C62.1 U10.3(VIN) U11.3(VIN) ; port PWR_IN
3V3_3V3_INT_V_SENSE: R50.2 R51.1 ; port 3V3_V_SENSE
3V3_5V0_INT_V_SENSE: D?#3.1(K) R48.2 R49.1 ; port 5V0_V_SENSE

### Notes on the sheet
- Schematics Checked - Dec 03 2025
  - Reg layout ok
  - V sense dividers ok

### Library data of the parts
C60 C62 = CMP-001-00058-1: as C66-C70 on sheet LM74910H_PINOUT; Min Operating Temperature: -55°C; Mounting Technology: Surface Mount; Pins: 2; Case/Package: 0402; RoHS Compliant: Yes; Max Operating Temperature: 85°C
C61 C63 = CMP-001-00000-11: Non-polarized capacitor
D?#3 = CMP-1060-00750-1: as D9 on sheet LM74910H_PINOUT; RoHS: Pb-Free; ComponentLink2Description: Datasheet; PackageReference: SOD-523-2-502-01; DatasheetVersion: Rev. 10; ComponentLink1Description: Manufacturer URL; PackageVersion: Rev. E, 09/2010; ComponentLink3URL: http://www.onsemi.com/pub_link/Collateral/502-01.PDF; ComponentLink2URL: http://www.onsemi.cn/pub_link/Collateral/MM5Z2V4T1-D.PDF; Mounting Technology: Surface Mount; PartNumber: MM5Z3V3T1G; Packing: Tape and Reel; PackageDescription: 2-Pin SOD, Body 1.2 x 0.8 mm; ComponentLink1URL: http://www.onsemi.com/; ComponentLink3Description: Package Specification
R48-R51 = CMP-009-00002-14: Resistor
  R48 R49 R51: Value: 100k
  R50: Value: 10k
U10 = CMP-0244-00312-1: Fixed Low Drop Positive Voltage Regulator, 5V, 4-Pin SOT-223, Tape and Reel; ComponentLink1URL: http://www.st.com; DatasheetVersion: 1/11/2011; PackageDescription: 4-Pin SOT-223 Package, 6.5 x 3.5 mm Body, 2.3 mm Pitch, 7 mm Lead Span; ComponentLink2URL: http://www.st.com/internet/com/TECHNICAL_RESOURCES/TECHNICAL_LITERATURE/DATASHEET/CD00000544.pdf; ComponentLink1Description: Manufacturer URL; PackageReference: SOT-223; PackageVersion: 2010; ComponentLink2Description: Datasheet
U11 = CMP-0244-00310-1: Fixed Low Drop Positive Voltage Regulator, 3.3V, 4-Pin SOT-223, Tape and Reel; ComponentLink2Description: Datasheet; PackageDescription: 4-Pin SOT-223 Package, 6.5 x 3.5 mm Body, 2.3 mm Pitch, 7 mm Lead Span; PackageVersion: 2010; ComponentLink2URL: http://www.st.com/internet/com/TECHNICAL_RESOURCES/TECHNICAL_LITERATURE/DATASHEET/CD00000544.pdf; PackageReference: SOT-223; DatasheetVersion: 1/11/2011; ComponentLink1Description: Manufacturer URL; ComponentLink1URL: http://www.st.com

## Sheet ADC.SchDoc
size A; SheetNumber: 13; SheetTotal: 23
Used 3 times, as channels ADC_1, ADC_0, ADC_2. Parts and nets are listed once, with the designators drawn on the sheet.
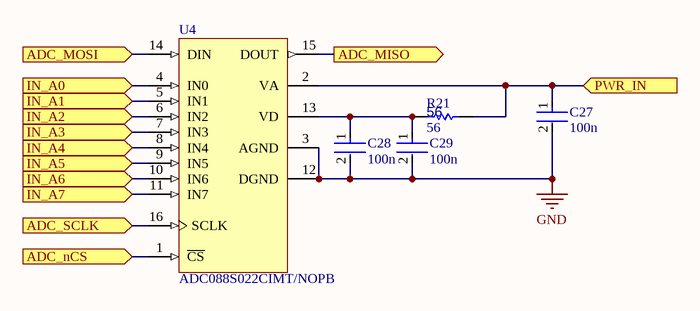
[diagram p28: ADC.SchDoc]

### Parts
C27  100n  [FP-0402-L_1_0_0_05-W_0_5-IPC_A]
C28  100n  [FP-0402-L_1_0_0_05-W_0_5-IPC_A]
C29  100n  [FP-0402-L_1_0_0_05-W_0_5-IPC_A]
R21  56  [R0603B]
U4  ADC088S022CIMT/NOPB  [MTC16_L]

### Ports
ADC_MISO (out, see ADAS_ECU_revA[5D]), ADC_MOSI (in, see ADAS_ECU_revA[5D]), ADC_nCS (in), ADC_SCLK (in, see ADAS_ECU_revA[5D]), IN_A0 (in), IN_A1 (in), IN_A2 (in), IN_A3 (in), IN_A4 (in), IN_A5 (in), IN_A6 (in), IN_A7 (in), PWR_IN (in)

### Nets
GND: C27.2 C28.2 C29.2 U4.3(AGND) U4.12(DGND)
ADC_MISO: U4.15(DOUT) ; port ADC_MISO
ADC_MOSI: U4.14(DIN) ; port ADC_MOSI
ADC_nCS: U4.1(~{CS}) ; port ADC_nCS
ADC_SCLK: U4.16(SCLK) ; port ADC_SCLK
IN_A0: U4.4(IN0) ; port IN_A0
IN_A1: U4.5(IN1) ; port IN_A1
IN_A2: U4.6(IN2) ; port IN_A2
IN_A3: U4.7(IN3) ; port IN_A3
IN_A4: U4.8(IN4) ; port IN_A4
IN_A5: U4.9(IN5) ; port IN_A5
IN_A6: U4.10(IN6) ; port IN_A6
IN_A7: U4.11(IN7) ; port IN_A7
PWR_IN: C27.1 R21.1 U4.2(VA) ; port PWR_IN
NetC28_1: C28.1 C29.1 R21.2 U4.13(VD)

### Channels
ADC_1: designators end in _ADC_1; ports ADC_MISO=NetU4_ADC_1_15 ADC_MOSI=NetU4_ADC_1_14 ADC_nCS=NetU4_ADC_1_1 ADC_SCLK=NetU4_ADC_1_16 IN_A0=NetU4_ADC_1_4 IN_A1=NetU4_ADC_1_5 IN_A2=NetU4_ADC_1_6 IN_A3=NetU4_ADC_1_7 IN_A4=NetU4_ADC_1_8 IN_A5=NetU4_ADC_1_9 IN_A6=NetU4_ADC_1_10 IN_A7=NetU4_ADC_1_11 PWR_IN=NetC27_ADC_1_1
ADC_0: designators end in _ADC_0; ports ADC_MISO=NetU4_ADC_0_15 ADC_MOSI=NetU4_ADC_0_14 ADC_nCS=NetU4_ADC_0_1 ADC_SCLK=NetU4_ADC_0_16 IN_A0=NetU4_ADC_0_4 IN_A1=NetU4_ADC_0_5 IN_A2=NetU4_ADC_0_6 IN_A3=NetU4_ADC_0_7 IN_A4=NetU4_ADC_0_8 IN_A5=NetU4_ADC_0_9 IN_A6=NetU4_ADC_0_10 IN_A7=NetU4_ADC_0_11 PWR_IN=NetC27_ADC_0_1
ADC_2: designators end in _ADC_2; ports ADC_MISO=NetU4_ADC_2_15 ADC_MOSI=NetU4_ADC_2_14 ADC_nCS=NetU4_ADC_2_1 ADC_SCLK=NetU4_ADC_2_16 IN_A0=NetU4_ADC_2_4 IN_A1=NetU4_ADC_2_5 IN_A2=NetU4_ADC_2_6 IN_A3=NetU4_ADC_2_7 IN_A4=NetU4_ADC_2_8 IN_A5=NetU4_ADC_2_9 IN_A6=NetU4_ADC_2_10 IN_A7=NetU4_ADC_2_11 PWR_IN=NetC27_ADC_2_1

### Library data of the parts
C27-C29 = CMP-001-00058-1: as C66-C70 on sheet LM74910H_PINOUT; Min Operating Temperature: -55°C; Mounting Technology: Surface Mount; Pins: 2; Case/Package: 0402; RoHS Compliant: Yes; Max Operating Temperature: 85°C
R21 = CMP-009-00002-14: Resistor; Value: 56
U4 = CMP-0054-00372-2: 8-Channel, 50 kSPS to 200 kSPS, 8-Bit A/D Converter, 16-pin TSSOP, Pb-Free; Manufacturer: National Semiconductor; PackageTopMarking: NSUZXYTT*88S022*CIMT; CompType: ADC IC; PowerWise: Y; ComponentLink2URL: http://www.national.com/pf/AD/ADC088S022.html; RoHS: Y; PackageDescription: Molded TSSOP, Jedec, 5 x 4.4 x 0.9mm Body, 16 Lead, 0.65mm Pitch; DatasheetVersion: Feb-2010; PinCount: 16; ComponentLink1Description: ADC088S022 Datasheet; Code_JEDEC: MO-153-AB; ComponentLink3URL: http://www.national.com/packaging/folders/mtc16.html; PackageVersion: revD, Jun-2003; ComponentLink3Description: MTC16 Package Page; RevisionNote: Component URLs added; ComponentLink1URL: http://www.national.com/ds/AD/ADC088S022.pdf; ComponentLink2Description: ADC088S022 Web Page; PackageReference: MTC16